# EAGLE design hsa_stm32_board (EAGLE 6.5.0)

## Sheet 1 of 3
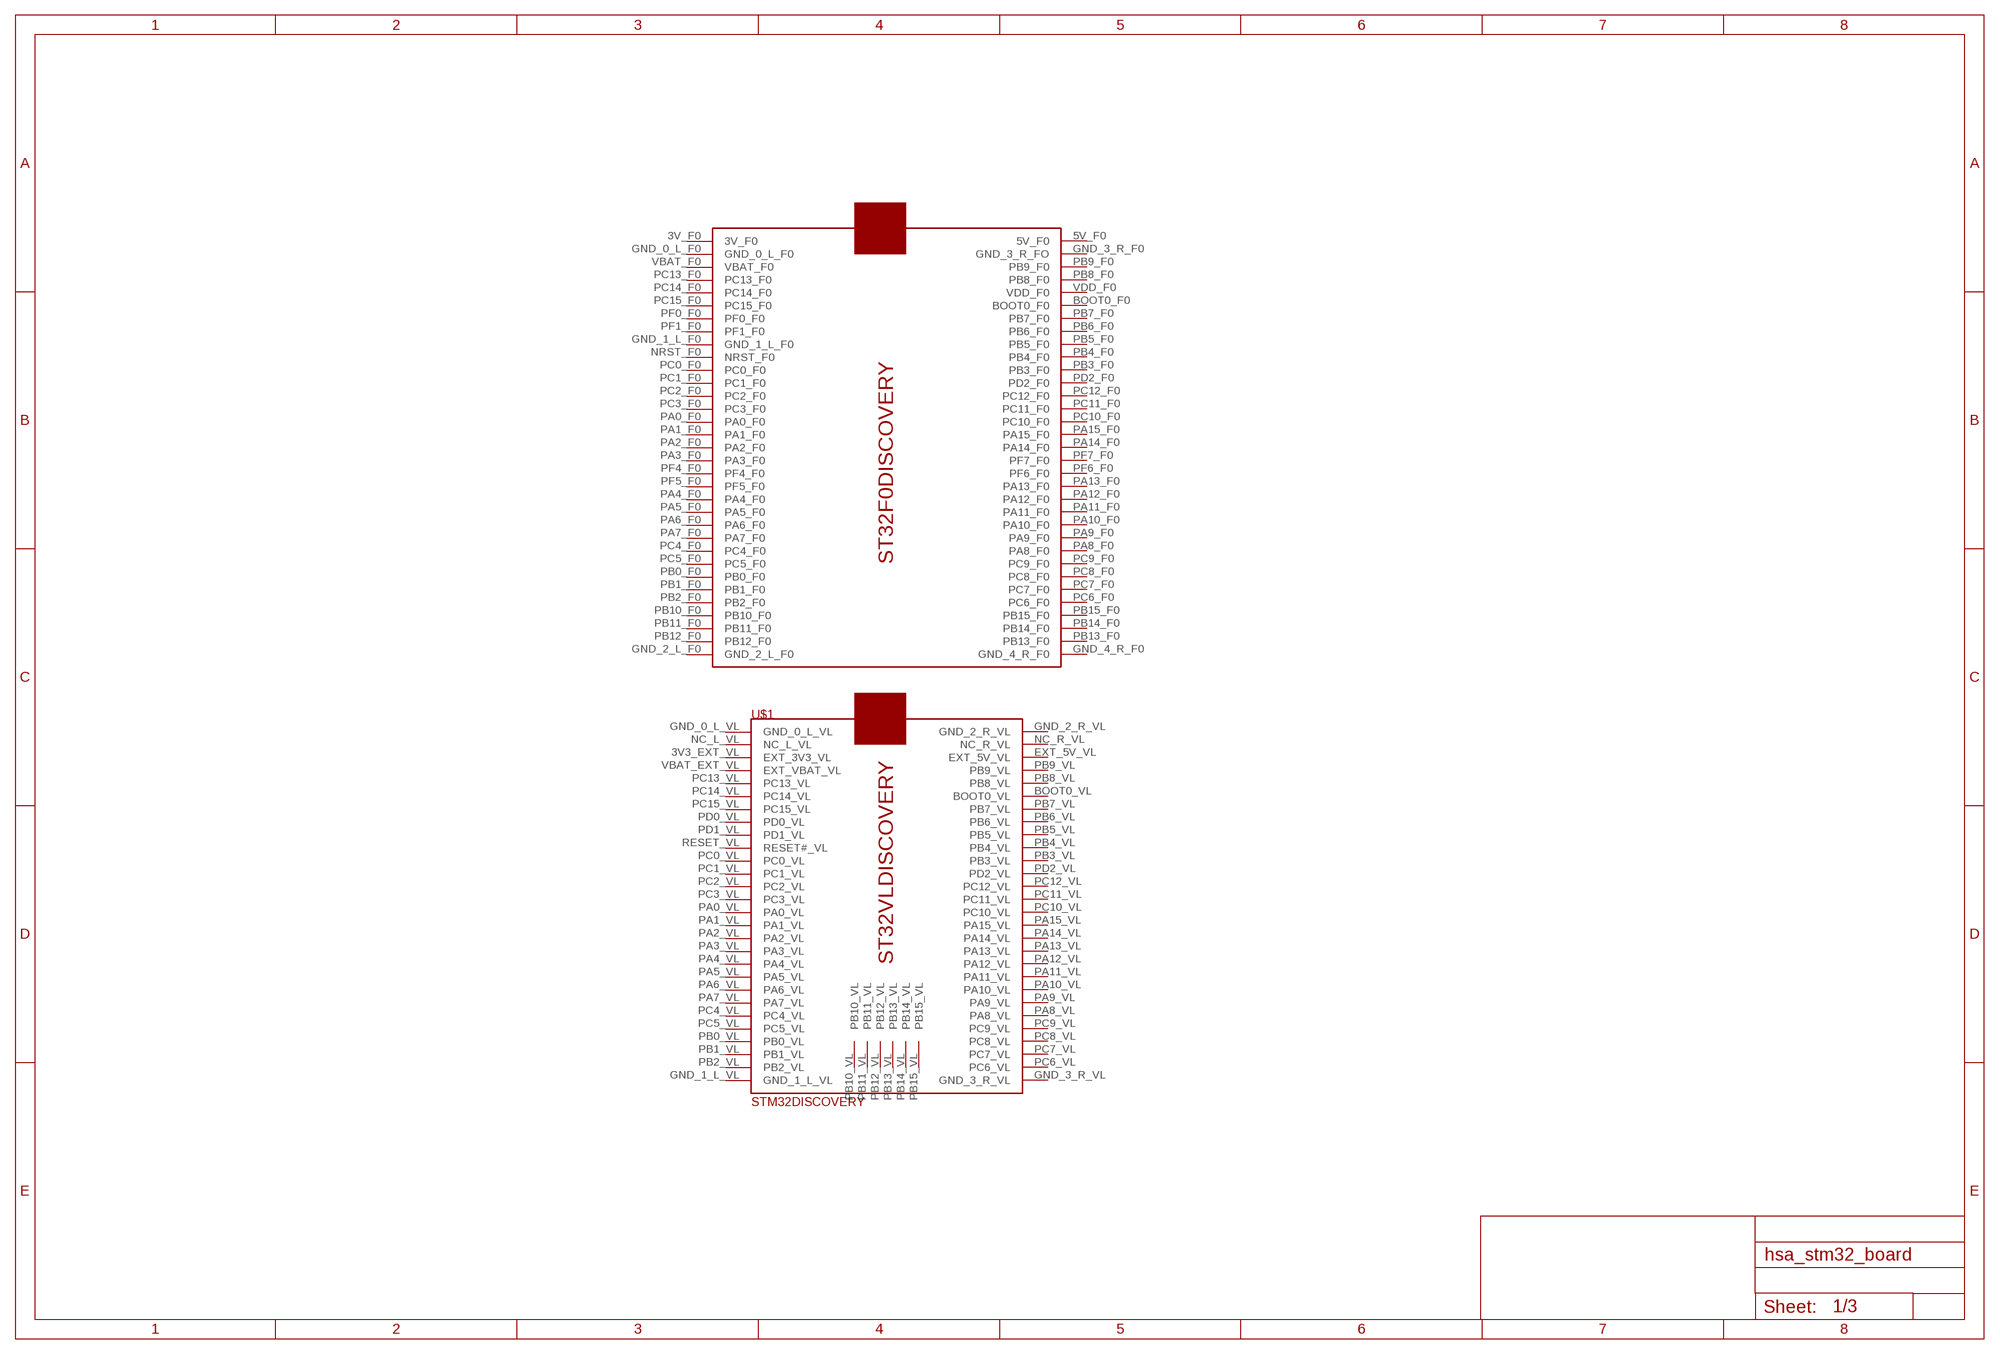
[diagram p0: schematic, sheet 1]

### Parts
U$1  STM32DISCOVERY  [STM32DISCOVERY]
Unconnected: U$1.3V3_EXT_VL(EXT_3V3_VL) U$1.3V_F0 U$1.5V_F0 U$1.BOOT0_F0 U$1.BOOT0_VL U$1.EXT_5V_VL U$1.GND_0_L_F0 U$1.GND_0_L_VL U$1.GND_1_L_F0 U$1.GND_2_L_F0 U$1.GND_2_R_VL U$1.GND_3_R_F0(GND_3_R_FO) U$1.GND_3_R_VL U$1.GND_4_R_F0 U$1.NC_L_VL U$1.NC_R_VL U$1.NRST_F0 U$1.PA0_F0 U$1.PA0_VL U$1.PA1_F0 U$1.PA1_VL U$1.PA2_F0 U$1.PA2_VL U$1.PA3_F0 U$1.PA3_VL U$1.PA4_F0 U$1.PA4_VL U$1.PA5_F0 U$1.PA5_VL U$1.PA6_F0 U$1.PA6_VL U$1.PA7_F0 U$1.PA7_VL U$1.PA8_F0 U$1.PA8_VL U$1.PA9_F0 U$1.PA9_VL U$1.PA10_F0 U$1.PA10_VL U$1.PA11_F0 U$1.PA11_VL U$1.PA12_F0 U$1.PA12_VL U$1.PA13_F0 U$1.PA13_VL U$1.PA14_F0 U$1.PA14_VL U$1.PA15_F0 U$1.PA15_VL U$1.PB0_F0 U$1.PB0_VL U$1.PB1_F0 U$1.PB1_VL U$1.PB2_F0 U$1.PB2_VL U$1.PB3_F0 U$1.PB3_VL U$1.PB4_F0 U$1.PB4_VL U$1.PB5_F0 U$1.PB5_VL U$1.PB6_F0 U$1.PB6_VL U$1.PB7_F0 U$1.PB7_VL U$1.PB8_F0 U$1.PB8_VL U$1.PB9_F0 U$1.PB9_VL U$1.PB10_F0 U$1.PB10_VL U$1.PB11_F0 U$1.PB11_VL U$1.PB12_F0 U$1.PB12_VL U$1.PB13_F0 U$1.PB13_VL U$1.PB14_F0 U$1.PB14_VL U$1.PB15_F0 U$1.PB15_VL U$1.PC0_F0 U$1.PC0_VL U$1.PC1_F0 U$1.PC1_VL U$1.PC2_F0 U$1.PC2_VL U$1.PC3_F0 U$1.PC3_VL U$1.PC4_F0 U$1.PC4_VL U$1.PC5_F0 U$1.PC5_VL U$1.PC6_F0 U$1.PC6_VL U$1.PC7_F0 U$1.PC7_VL U$1.PC8_F0 U$1.PC8_VL U$1.PC9_F0 U$1.PC9_VL U$1.PC10_F0 U$1.PC10_VL U$1.PC11_F0 U$1.PC11_VL U$1.PC12_F0 U$1.PC12_VL U$1.PC13_F0 U$1.PC13_VL U$1.PC14_F0 U$1.PC14_VL U$1.PC15_F0 U$1.PC15_VL U$1.PD0_VL U$1.PD1_VL U$1.PD2_F0 U$1.PD2_VL U$1.PF0_F0 U$1.PF1_F0 U$1.PF4_F0 U$1.PF5_F0 U$1.PF6_F0 U$1.PF7_F0 U$1.RESET_VL(RESET#_VL) U$1.VBAT_EXT_VL(EXT_VBAT_VL) U$1.VBAT_F0 U$1.VDD_F0

## Sheet 2 of 3
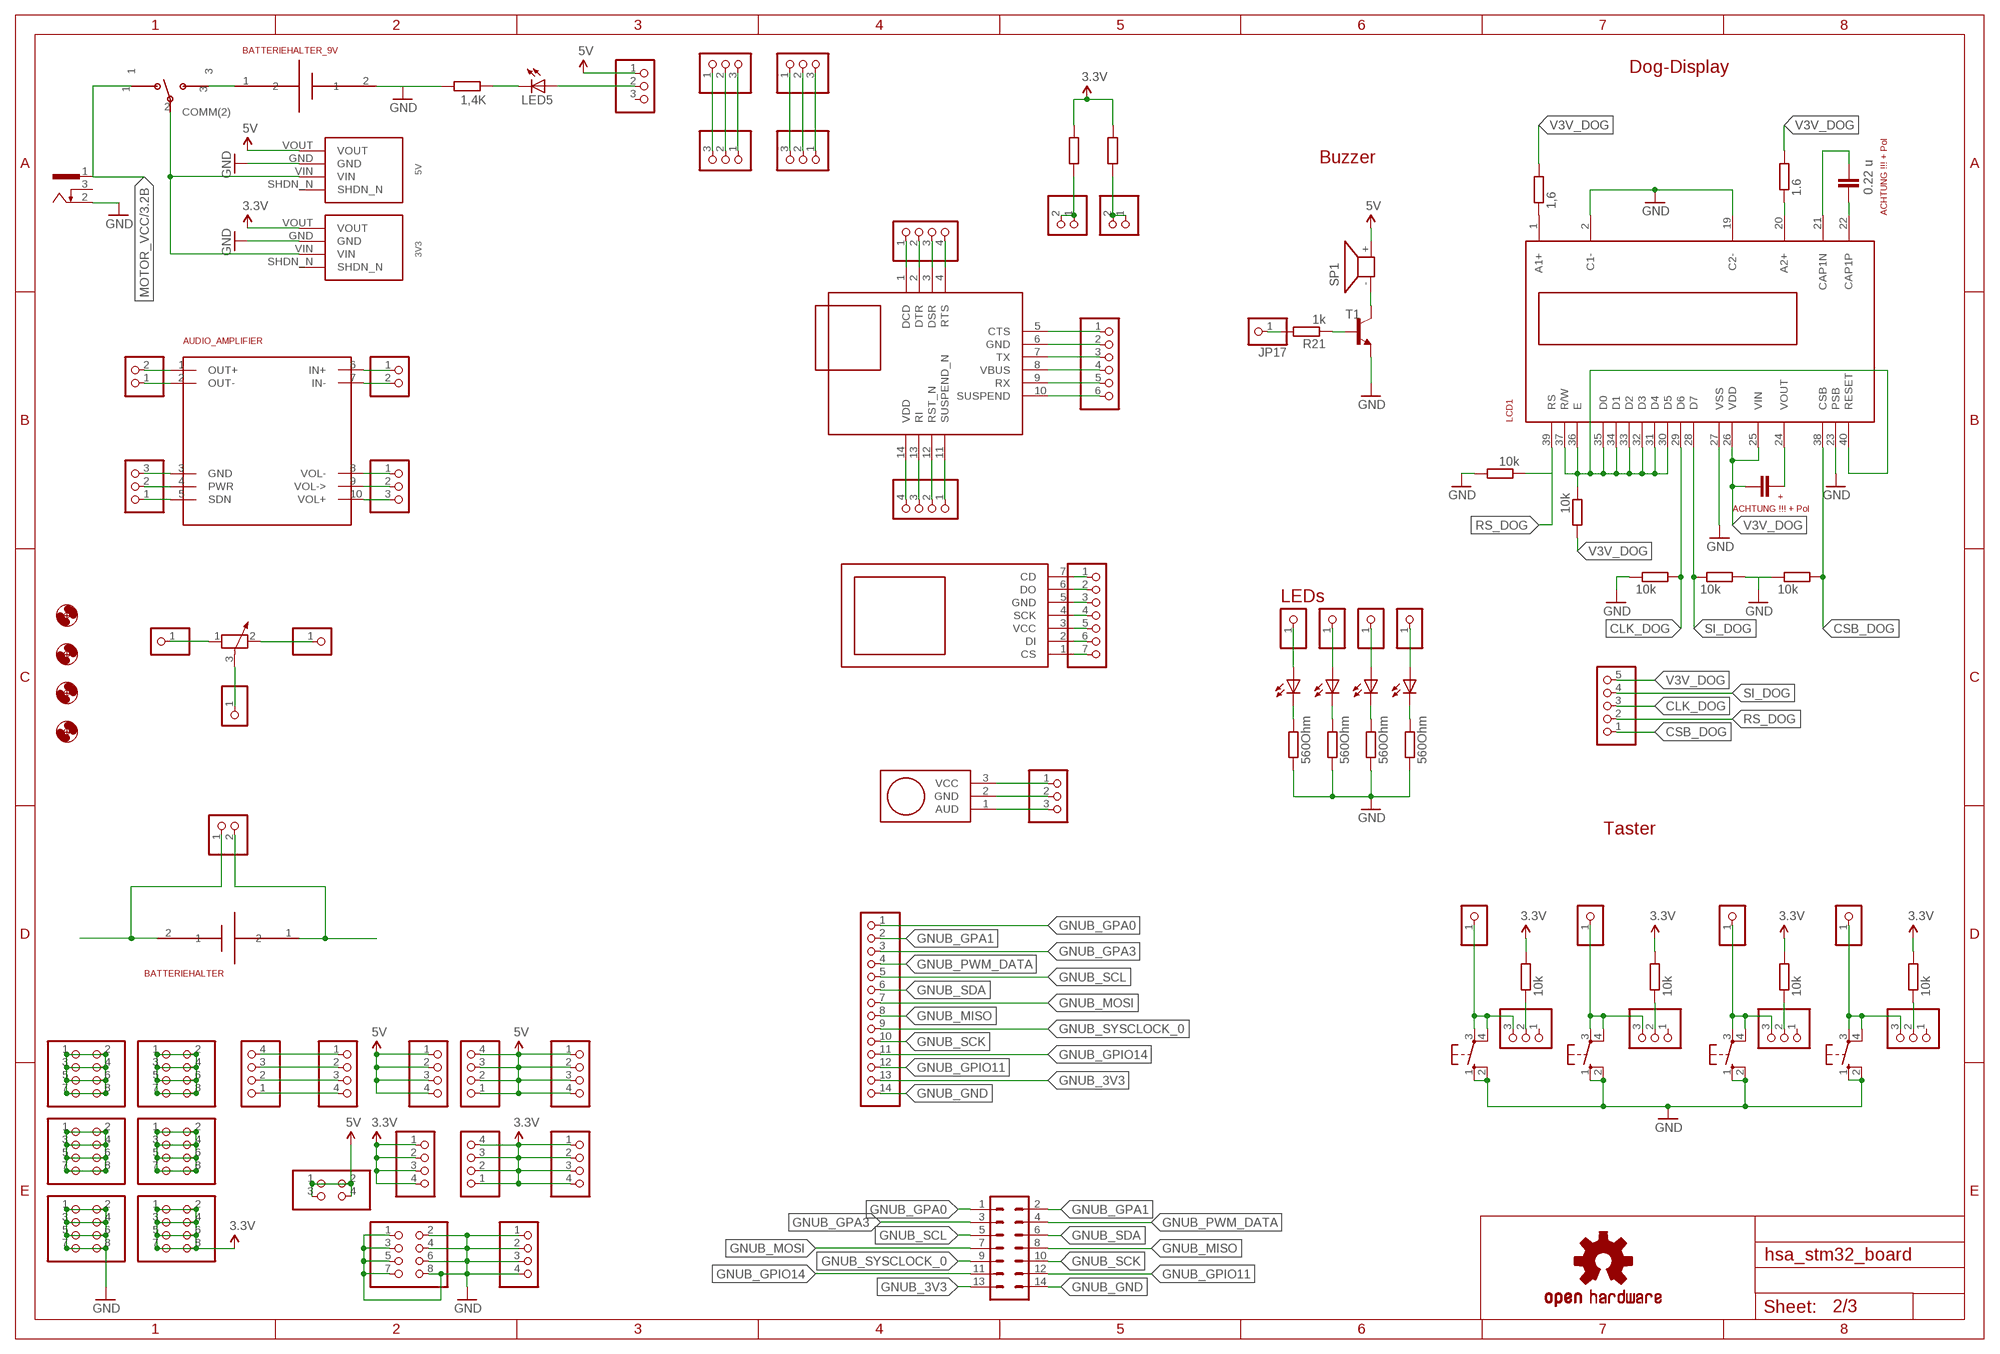
[diagram p1: schematic, sheet 2]

### Parts
3V3  VOLTAGE_REGULATOR  [VOL_REG]
5V  VOLTAGE_REGULATOR  [VOL_REG]
C2  0.22 u  C-EU025-040X050  [C025-040X050]
C3  1 u  C-EU025-040X050  [C025-040X050]
H1  MOUNT-HOLE6.0  [6,0]
H2  MOUNT-HOLE6.0  [6,0]
H3  MOUNT-HOLE6.0  [6,0]
H4  MOUNT-HOLE6.0  [6,0]
JP1  PINHD-1X5  [1X05]
JP4  PINHD-1X3  [1X03]
JP5  PINHD-1X1  [1X01]
JP6  PINHD-1X1  [1X01]
JP7  PINHD-1X1  [1X01]
JP8  PINHD-1X1  [1X01]
JP9  PINHD-1X1  [1X01]
JP10  PINHD-1X1  [1X01]
JP11  PINHD-1X1  [1X01]
JP12  PINHD-1X1  [1X01]
JP14  PINHD-1X1  [1X01]
JP15  PINHD-1X1  [1X01]
JP16  PINHD-1X1  [1X01]
JP17  PINHD-1X1  [1X01]
JP18  PINHD-2X4  [2X04]
JP24  PINHD-1X4  [1X04]
JP27  PINHD-1X4/90  [1X04/90]
JP28  PINHD-1X4  [1X04]
JP29  PINHD-1X4  [1X04]
JP30  PINHD-1X3  [1X03]
JP31  PINHD-1X2  [1X02]
JP32  PINHD-1X2  [1X02]
JP33  PINHD-1X3  [1X03]
JP34  PINHD-1X3  [1X03]
JP36  PINHD-1X4  [1X04]
JP37  PINHD-1X4  [1X04]
JP38  PINHD-1X6  [1X06]
JP39  PINHD-1X7  [1X07]
JP40  PINHD-1X4  [1X04]
JP41  PINHD-1X4  [1X04]
JP42  PINHD-1X4  [1X04]
JP43  PINHD-1X2  [1X02]
JP44  PINHD-2X4  [2X04]
JP45  PINHD-2X4  [2X04]
JP47  PINHD-1X4  [1X04]
JP48  PINHD-1X4  [1X04]
JP49  PINHD-1X3/90  [1X03/90]
JP50  PINHD-1X3  [1X03]
JP51  PINHD-1X3/90  [1X03/90]
JP52  PINHD-1X3  [1X03]
JP59  PINHD-1X3  [1X03]
JP60  PINHD-1X3  [1X03]
JP61  PINHD-1X3  [1X03]
JP62  PINHD-1X3  [1X03]
JP64  PINHD-1X14  [1X14]
JP65  PINHD-1X2  [1X02]
JP66  PINHD-1X2  [1X02]
JP67  PINHD-2X4  [2X04]
JP68  PINHD-2X4  [2X04]
JP69  PINHD-2X4  [2X04]
JP70  PINHD-2X4  [2X04]
JP71  PINHD-2X2  [2X02]
LCD1  ZEITERFASSUNG_-OPTO_DOGM  [ZEITERFASSUNG_-OPTO_DOGM]
LED1  LED5MM  [LED5MM]
LED2  LED5MM  [LED5MM]
LED3  LED5MM  [LED5MM]
LED4  LED5MM  [LED5MM]
LED5  LED5MM  [LED5MM]
LOGO1  OSHW-LOGOL  [OSHW-LOGO-L]
R1  560Ohm  R-EU_0207/10  [0207/10]
R2  560Ohm  R-EU_0207/10  [0207/10]
R3  560Ohm  R-EU_0207/10  [0207/10]
R4  560Ohm  R-EU_0207/10  [0207/10]
R5  RCL_POTENTIOMETER_PT-10  [RCL_PT-10]
R6  1,4K  R-EU_0207/10  [0207/10]
R7  1.6  R-EU_0207/10  [0207/10]
R8  1,6  R-EU_0207/10  [0207/10]
R9  10k  R-EU_0207/10  [0207/10]
R10  10k  R-EU_0207/10  [0207/10]
R11  10k  R-EU_0207/10  [0207/10]
R12  10k  R-EU_0207/10  [0207/10]
R13  10k  R-EU_0207/10  [0207/10]
R14  10k  R-EU_0207/10  [0207/10]
R15  10k  R-EU_0207/10  [0207/10]
R16  10k  R-EU_0207/10  [0207/10]
R17  10k  R-EU_0207/10  [0207/10]
R21  1k  R-EU_0207/10  [0207/10]
R22  R-EU_0207/10  [0207/10]
R23  R-EU_0207/10  [0207/10]
S1  CPU-K_MODULE_REV3.0_SWITCH-OMRON_10-XX  [CPU-K_MODULE_REV3.0_SWITCH-OMRON_B3F-10XX]
S2  CPU-K_MODULE_REV3.0_SWITCH-OMRON_10-XX  [CPU-K_MODULE_REV3.0_SWITCH-OMRON_B3F-10XX]
S3  CPU-K_MODULE_REV3.0_SWITCH-OMRON_10-XX  [CPU-K_MODULE_REV3.0_SWITCH-OMRON_B3F-10XX]
S4  CPU-K_MODULE_REV3.0_SWITCH-OMRON_10-XX  [CPU-K_MODULE_REV3.0_SWITCH-OMRON_B3F-10XX]
SP1  BUZZER_F/PMX04  [BUZZER_F/PMX04A]
SV3  ML14  [ML14]
T1  TRANSISTOR_BC337  [TRANSISTOR_TO92]
U$2  USB_TO_SERIAL_ADAPTER  [USB_TO_SERIAL]
U$4  KIPPSCHALTER(EIN,AUS,EIN)  [KIPPSCHALTER]
U$5  MIC  [MIC]
U$6  BATTERIEHALTER  [BH_KZH_20]
U$7  BATTERIEHALTER_9V  [BATTERIEHALTER_9V]
U$9  AUDIO_AMPLIFIER  [AUDIO_AMPLIFIER]
U$12  MICRO_SD_HALTER  [MIKRO_SD_HALTER]
X1  733980-62  [733980-62]

### Nets
3.3V: 3V3.VOUT JP29.1 JP29.2 JP29.3 JP29.4 JP41.1 JP41.2 JP41.3 JP41.4 JP47.1 JP47.2 JP47.3 JP47.4 JP70.1 JP70.2 JP70.3 JP70.4 JP70.5 JP70.6 JP70.7 JP70.8 R14.2 R15.2 R16.2 R17.2 R22.2 R23.2 ; also sheet 3
5V: 5V.VOUT JP4.1 JP28.1 JP28.2 JP28.3 JP28.4 JP40.1 JP40.2 JP40.3 JP40.4 JP48.1 JP48.2 JP48.3 JP48.4 JP71.1 JP71.2 JP71.3 JP71.4 SP1.+ ; also sheet 3
CLK_DOG: JP1.3 LCD1.29(D6) R11.2
CSB_DOG: JP1.1 LCD1.38(CSB) R13.2
GND: 3V3.GND 5V.GND JP18.1 JP18.2 JP18.3 JP18.4 JP18.5 JP18.6 JP18.7 JP18.8 JP42.1 JP42.2 JP42.3 JP42.4 JP67.1 JP67.2 JP67.3 JP67.4 JP67.5 JP67.6 JP67.7 JP67.8 LCD1.2(C1-) LCD1.19(C2-) LCD1.23(PSB) LCD1.27(VSS) R1.1 R2.1 R3.1 R4.1 R6.2 R9.2 R11.1 R12.2 R13.1 S1.1(S) S1.2(S1) S2.1(S) S2.2(S1) S3.1(S) S3.2(S1) S4.1(S) S4.2(S1) T1.1(E) U$7.2 X1.2 ; also sheet 3
GNUB_3V3: JP64.13 SV3.13
GNUB_GND: JP64.14 SV3.14
GNUB_GPA0: JP64.1 SV3.1
GNUB_GPA1: JP64.2 SV3.2
GNUB_GPA3: JP64.3 SV3.3
GNUB_GPIO11: JP64.12 SV3.12
GNUB_GPIO14: JP64.11 SV3.11
GNUB_MISO: JP64.8 SV3.8
GNUB_MOSI: JP64.7 SV3.7
GNUB_PWM_DATA: JP64.4 SV3.4
GNUB_SCK: JP64.10 SV3.10
GNUB_SCL: JP64.5 SV3.5
GNUB_SDA: JP64.6 SV3.6
GNUB_SYSCLOCK_0: JP64.9 SV3.9
MOTOR_VCC: U$4.1 X1.1 ; also sheet 3
N$1: C2.2 LCD1.22(CAP1P)
N$2: C2.1 LCD1.21(CAP1N)
N$3: LCD1.20(A2+) R7.1
N$4: LCD1.30(D5) LCD1.31(D4) LCD1.32(D3) LCD1.33(D2) LCD1.34(D1) LCD1.35(D0) LCD1.36(E) LCD1.37(R/W) LCD1.40(RESET) R10.1
N$5: LCD1.1(A1+) R8.1
N$6: C3.2 LCD1.24(VOUT)
N$7: LED4.K(C) R4.2
N$8: LED3.K(C) R3.2
N$9: LED2.K(C) R2.2
N$10: LED1.K(C) R1.2
N$13: JP6.1 LED2.A
N$14: JP7.1 LED3.A
N$15: JP8.1 LED4.A
N$16: 3V3.VIN 5V.VIN U$4.2(COMM(2))
N$18: JP62.2 R14.1
N$19: JP61.2 R15.1
N$20: JP9.1 JP62.3 S1.3(P) S1.4(P1)
N$21: JP10.1 JP61.3 S2.3(P) S2.4(P1)
N$22: JP60.2 R16.1
N$23: JP59.2 R17.1
N$24: JP11.1 JP60.3 S3.3(P) S3.4(P1)
N$25: JP12.1 JP59.3 S4.3(P) S4.4(P1)
N$27: U$4.3 U$7.1
N$28: LED5.K(C) R6.1
N$29: JP4.2 LED5.A
N$30: JP5.1 LED1.A
N$33: JP14.1 R5.3
N$34: JP16.1 R5.1
N$35: JP15.1 R5.2
N$36: SP1.- T1.3(C)
N$37: JP43.1 U$6.2
N$39: JP17.1 R21.2
N$40: JP43.2 U$6.1
N$58: JP24.4 JP27.1
N$62: JP24.3 JP27.2
N$63: JP24.2 JP27.3
N$64: JP24.1 JP27.4
N$65: JP32.2 U$9.1(OUT+)
N$66: JP32.1 U$9.2(OUT-)
N$67: JP31.1 U$9.6(IN+)
N$68: JP31.2 U$9.7(IN-)
N$69: JP34.1 U$9.8(VOL-)
N$70: JP49.3 JP50.1
N$71: JP49.2 JP50.2
N$72: JP49.1 JP50.3
N$73: JP30.1 U$5.3(VCC)
N$74: JP30.2 U$5.2(GND)
N$75: JP30.3 U$5.1(AUD)
N$76: JP34.2 U$9.9(VOL->)
N$77: JP34.3 U$9.10(VOL+)
N$78: JP33.3 U$9.3(GND)
N$79: JP33.2 U$9.4(PWR)
N$80: JP33.1 U$9.5(SDN)
N$88: JP36.1 U$2.1(DCD)
N$89: JP36.2 U$2.2(DTR)
N$90: JP36.3 U$2.3(DSR)
N$91: JP36.4 U$2.4(RTS)
N$92: JP37.1 U$2.11(SUSPEND_N)
N$93: JP37.2 U$2.12(RST_N)
N$94: JP37.3 U$2.13(RI)
N$95: JP37.4 U$2.14(VDD)
N$96: JP38.1 U$2.5(CTS)
N$97: JP38.2 U$2.6(GND)
N$98: JP38.3 U$2.7(TX)
N$99: JP38.4 U$2.8(VBUS)
N$100: JP38.5 U$2.9(RX)
N$101: JP38.6 U$2.10(SUSPEND)
N$102: JP39.1 U$12.7(CD)
N$103: JP39.2 U$12.6(DO)
N$104: JP39.3 U$12.5(GND)
N$105: JP39.4 U$12.4(SCK)
N$106: JP39.5 U$12.3(VCC)
N$107: JP39.6 U$12.2(DI)
N$108: JP39.7 U$12.1(CS)
N$109: JP51.3 JP52.1
N$110: JP51.2 JP52.2
N$111: JP51.1 JP52.3
N$112: R21.1 T1.2(B)
N$125: JP65.1 JP65.2 R23.1
N$126: JP66.1 JP66.2 R22.1
N$128: JP44.1 JP44.2 JP44.3 JP44.4 JP44.5 JP44.6 JP44.7 JP44.8
N$132: JP45.1 JP45.2 JP45.3 JP45.4 JP45.5 JP45.6 JP45.7 JP45.8
N$136: JP68.1 JP68.2 JP68.3 JP68.4 JP68.5 JP68.6 JP68.7 JP68.8
N$140: JP69.1 JP69.2 JP69.3 JP69.4 JP69.5 JP69.6 JP69.7 JP69.8
RS_DOG: JP1.2 LCD1.39(RS) R9.1
SI_DOG: JP1.4 LCD1.28(D7) R12.1
V3V_DOG: C3.1 JP1.5 LCD1.25(VIN) LCD1.26(VDD) R7.2 R8.2 R10.2
Unconnected: 3V3.SHDN_N 5V.SHDN_N JP4.3 JP59.1 JP60.1 JP61.1 JP62.1 X1.3

### Notes on the sheet
- Dog-Display
- Buzzer
- ACHTUNG !!! + Pol
- +
- ACHTUNG !!! + Pol
- LEDs
- Taster

## Sheet 3 of 3
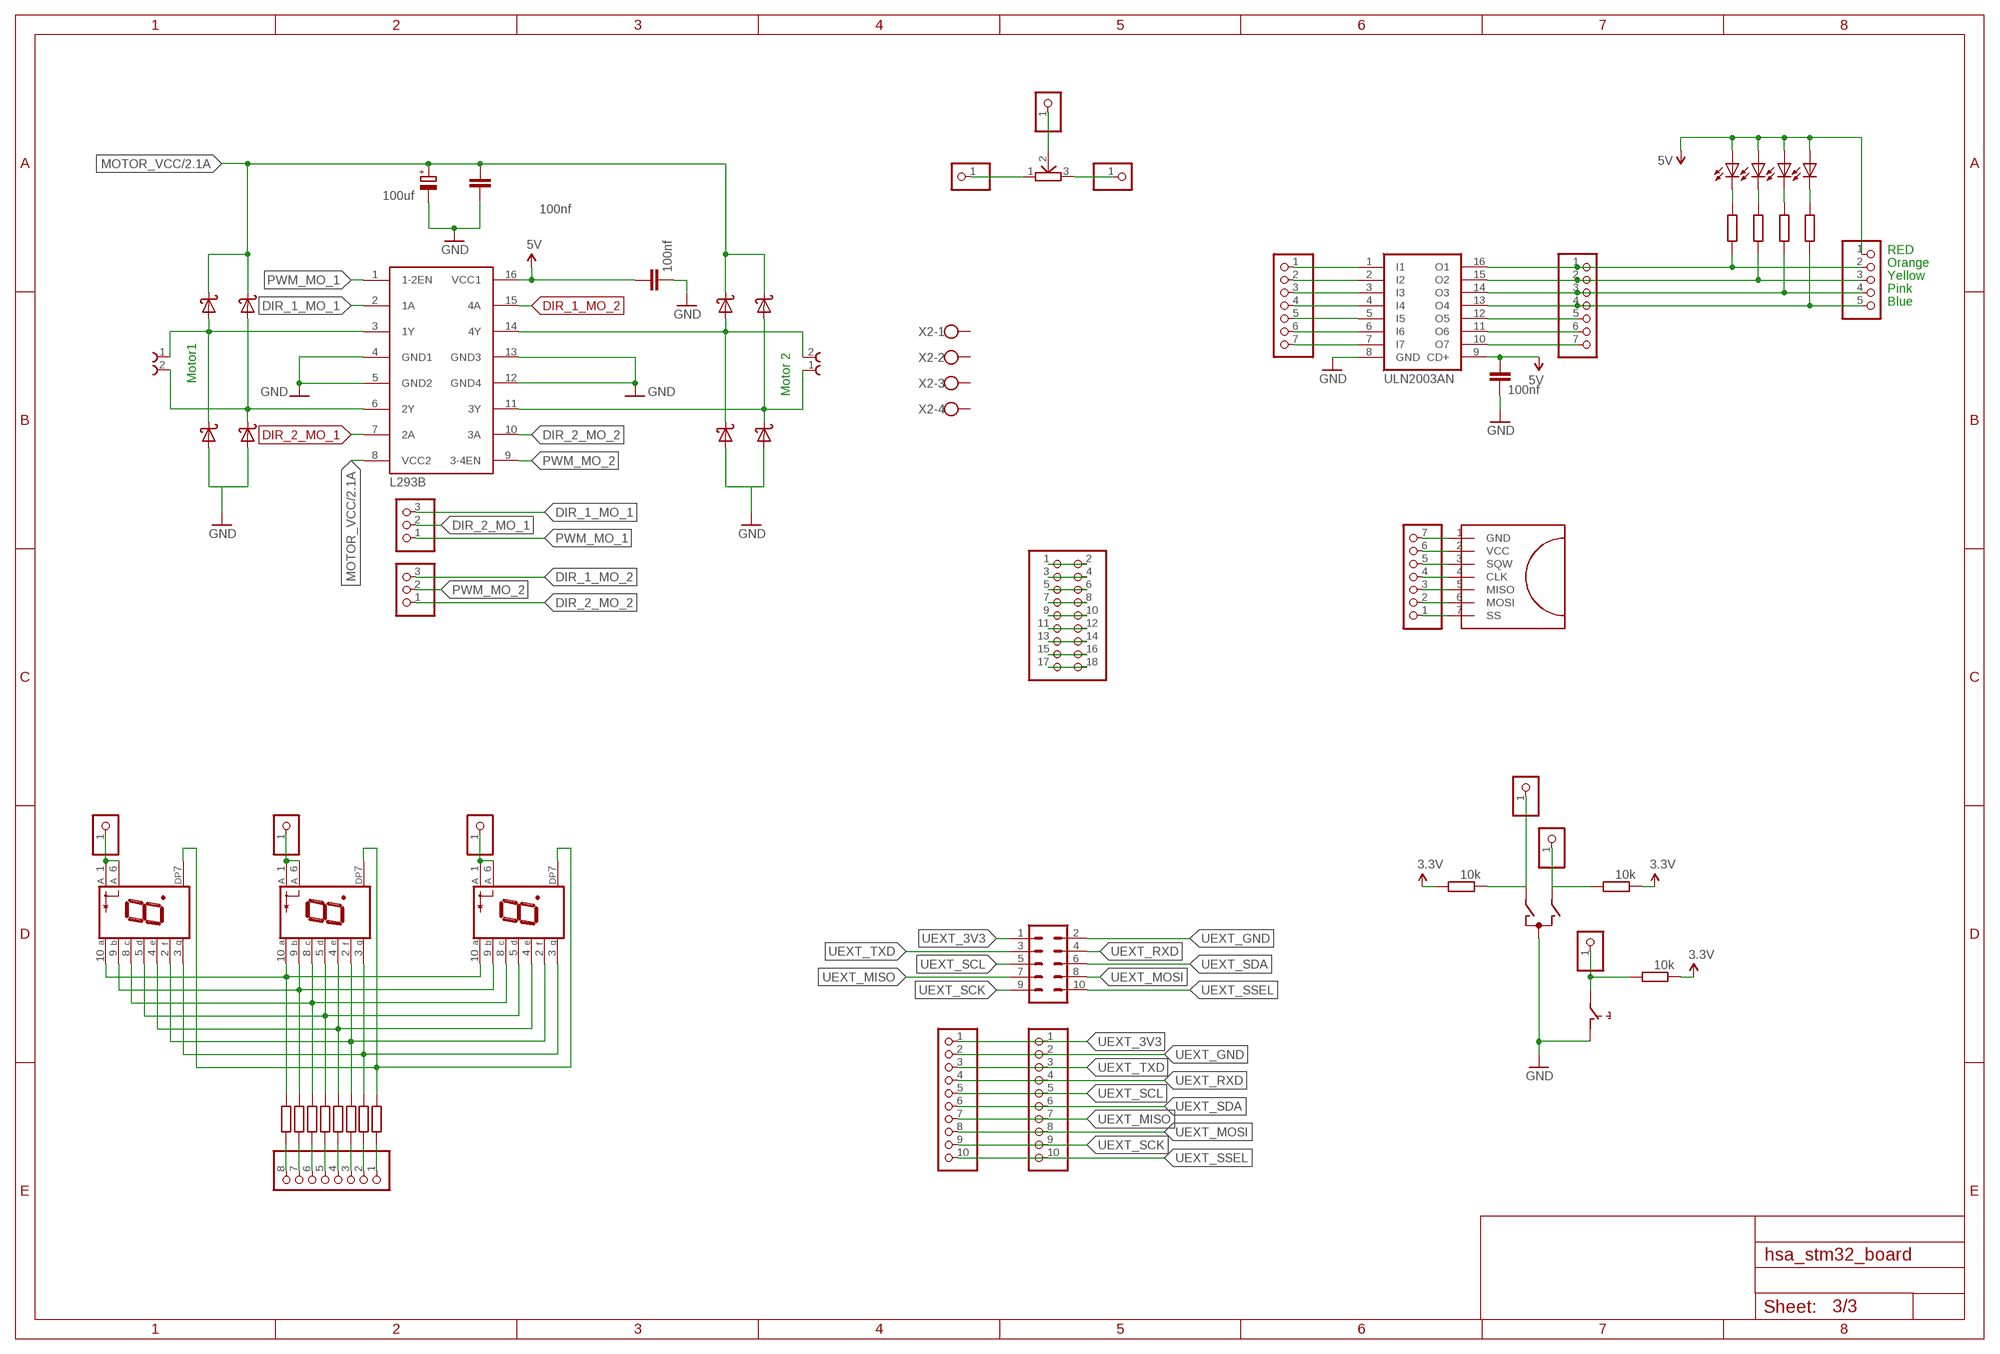
[diagram p2: schematic, sheet 3]

### Parts
C4  100nf  RCL_C-EU025-040X050  [RCL_C025-040X050]
C5  100nf  RCL_C-EU025-040X050  [RCL_C025-040X050]
C6  100nf  RCL_C-EU025-040X050  [RCL_C025-040X050]
C7  100uf  RCL_CPOL-EUE2.5-6  [RCL_E2,5-6]
D1  1N5819  [DO41-10]
D2  1N5819  [DO41-10]
D3  1N5819  [DO41-10]
D4  1N5819  [DO41-10]
D5  1N5819  [DO41-10]
D6  1N5819  [DO41-10]
D7  1N5819  [DO41-10]
D8  1N5819  [DO41-10]
IC1  ULN2003AN  [DIL16]
IC2  L293D  [DIL16]
JP2  PINHD-1X1  [1X01]
JP3  PINHD-1X1  [1X01]
JP13  PINHD-1X1  [1X01]
JP20  PINHD-1X10  [1X10]
JP21  PINHD-1X7  [1X07]
JP22  PINHD-1X8  [1X08]
JP23  PINHD-1X1  [1X01]
JP25  PINHD-1X5/90  [1X05/90]
JP26  PINHD-1X7  [1X07]
JP35  PINHD-1X7  [1X07]
JP53  PINHD-1X1  [1X01]
JP54  PINHD-1X1  [1X01]
JP55  PINHD-1X1  [1X01]
JP56  PINHD-2X9  [2X09]
JP57  PINHD-1X3  [1X03]
JP58  PINHD-1X3  [1X03]
JP63  PINHD-1X10  [1X10]
JP72  PINHD-1X1  [1X01]
JP73  PINHD-1X1  [1X01]
K1  691210910002  [691210910002]
K2  691210910002  [691210910002]
LED6  LA-401MD  [LA-401]
LED7  LA-401MD  [LA-401]
LED8  LA-401MD  [LA-401]
LED9  LED3MM  [LED3MM]
LED10  LED3MM  [LED3MM]
LED11  LED3MM  [LED3MM]
LED12  LED3MM  [LED3MM]
R18  10k  R-EU_0207/10  [0207/10]
R19  10k  R-EU_0207/10  [0207/10]
R20  10k  R-EU_0207/10  [0207/10]
R24  R-EU_0207/10  [0207/10]
R25  R-EU_0207/10  [0207/10]
R26  R-EU_0207/10  [0207/10]
R27  R-EU_0207/10  [0207/10]
R28  R-EU_0207/10  [0207/10]
R29  R-EU_0207/10  [0207/10]
R30  R-EU_0207/10  [0207/10]
R31  R-EU_0207/10  [0207/10]
R32  R-EU_0207/10  [0207/10]
R33  R-EU_0207/10  [0207/10]
R34  R-EU_0207/10  [0207/10]
R35  R-EU_0207/10  [0207/10]
SV2  CON-HARTING-ML_ML10  [CON-HARTING-ML_ML10]
SW1  EC12E_SW  [ALPS_EC12E_SW]
U$10  RTC  [RTC]
U$17  THUMBWHEEL_POTI  [THUMBWHEEL_POTI]
X2  W237-4  [W237-4]

### Nets
3.3V: R18.1 R19.2 R20.1 ; also sheet 2
5V: C4.1 C6.1 IC1.9(CD+) IC2.16(VCC1) JP25.1 LED9.A LED10.A LED11.A LED12.A ; also sheet 2
DIR_1_MO_1: IC2.2(1A) JP57.3
DIR_1_MO_2: IC2.15(4A) JP58.3
DIR_2_MO_1: IC2.7(2A) JP57.2
DIR_2_MO_2: IC2.10(3A) JP58.1
GND: C4.2 C5.2 C6.2 C7.- D3.A D4.A D7.A D8.A IC1.8(GND) IC2.4(GND1) IC2.5(GND2) IC2.12(GND4) IC2.13(GND3) SW1.C SW1.D ; also sheet 2
MOTOR_VCC: C5.1 C7.+ D1.C D2.C D5.C D6.C IC2.8(VCC2) ; also sheet 2
N$12: JP2.1 R19.1 SW1.A
N$17: LED9.K(C) R32.2
N$26: LED10.K(C) R34.2
N$31: JP3.1 R18.2 SW1.B
N$32: JP13.1 R20.2 SW1.E
N$38: D2.A D4.C IC2.14(4Y) K1.2
N$41: IC1.12(O5) JP21.5
N$42: IC1.11(O6) JP21.6
N$43: IC1.10(O7) JP21.7
N$44: IC1.5(I5) JP26.5
N$45: IC1.16(O1) JP21.1 JP25.2 R32.1
N$46: IC1.15(O2) JP21.2 JP25.3 R34.1
N$47: IC1.6(I6) JP26.6
N$48: IC1.7(I7) JP26.7
N$49: JP56.1 JP56.2
N$50: JP56.3 JP56.4
N$51: IC1.14(O3) JP21.3 JP25.4 R33.1
N$52: IC1.13(O4) JP21.4 JP25.5 R35.1
N$53: JP56.5 JP56.6
N$54: IC1.4(I4) JP26.4
N$55: IC1.3(I3) JP26.3
N$56: IC1.2(I2) JP26.2
N$57: IC1.1(I1) JP26.1
N$59: JP56.7 JP56.8
N$60: JP56.9 JP56.10
N$61: JP56.11 JP56.12
N$81: JP35.1 U$10.7(SS)
N$82: JP35.2 U$10.6(MOSI)
N$83: JP35.3 U$10.5(MISO)
N$84: JP35.4 U$10.4(CLK)
N$85: JP35.5 U$10.3(SQW)
N$86: JP35.6 U$10.2(VCC)
N$87: JP35.7 U$10.1(GND)
N$113: D1.A D3.C IC2.11(3Y) K1.1
N$114: JP55.1 U$17.1(A)
N$115: JP54.1 U$17.2(W)
N$116: D6.A D8.C IC2.3(1Y) K2.1
N$117: D5.A D7.C IC2.6(2Y) K2.2
N$118: JP53.1 U$17.3(B)
N$119: LED12.K(C) R35.2
N$120: LED11.K(C) R33.2
N$122: JP56.13 JP56.14
N$123: JP56.15 JP56.16
N$124: JP56.17 JP56.18
N$127: JP22.8 R24.1
N$131: LED6.9(B) LED7.9(B) LED8.9(B) R25.2
N$133: LED6.8(C) LED7.8(C) LED8.8(C) R26.2
N$134: LED6.5(D) LED7.5(D) LED8.5(D) R27.2
N$135: LED6.4(E) LED7.4(E) LED8.4(E) R28.2
N$139: LED6.2(F) LED7.2(F) LED8.2(F) R29.2
N$141: LED6.3(G) LED7.3(G) LED8.3(G) R30.2
N$142: LED6.7(DP) LED7.7(DP) LED8.7(DP) R31.2
N$143: LED6.10(A) LED7.10(A) LED8.10(A) R24.2
N$144: JP22.7 R25.1
N$145: JP22.6 R26.1
N$146: JP22.5 R27.1
N$147: JP22.4 R28.1
N$148: JP22.3 R29.1
N$149: JP22.2 R30.1
N$150: JP22.1 R31.1
N$151: JP72.1 LED6.1(A) LED6.6(A)
N$152: JP73.1 LED7.1(A) LED7.6(A)
N$153: JP23.1 LED8.1(A) LED8.6(A)
PWM_MO_1: IC2.1(1-2EN) JP57.1
PWM_MO_2: IC2.9(3-4EN) JP58.2
UEXT_3V3: JP20.1 JP63.1 SV2.1
UEXT_GND: JP20.2 JP63.2 SV2.2
UEXT_MISO: JP20.7 JP63.7 SV2.7
UEXT_MOSI: JP20.8 JP63.8 SV2.8
UEXT_RXD: JP20.4 JP63.4 SV2.4
UEXT_SCK: JP20.9 JP63.9 SV2.9
UEXT_SCL: JP20.5 JP63.5 SV2.5
UEXT_SDA: JP20.6 JP63.6 SV2.6
UEXT_SSEL: JP20.10 JP63.10 SV2.10
UEXT_TXD: JP20.3 JP63.3 SV2.3
Unconnected: SW1.GND1(G) SW1.GND2(G) X2.1 X2.2 X2.3 X2.4

### Notes on the sheet
- RED
- Orange
- Yellow
- Pink
- Blue
- Motor1
- Motor 2
- L293B

## Power pins joined to a net without a drawn wire
GND_1_L_VL: U$1.GND_1_L_VL

## Library data of the parts
3V3 5V = hsa_stm32_discovery_board:VOLTAGE_REGULATOR
C2 C3 = resistor:C-EU: CAPACITOR, European symbol
C4-C6 = v100_knicker:RCL_C-EU: CAPACITOR, European symbol
C7 = CPU-k_module_Rev3.0:RCL_CPOL-EU: POLARIZED CAPACITOR, European symbol
D1-D8 = CEDT:1N5819: DIODE general purpose rectifier, 1 A
H1-H4 = holes:MOUNT-HOLE: MOUNTING HOLE with drill center marker
IC1 = uln-udn:ULN2003A: DRIVER ARRAY
IC2 = st-microelectronics:L293D: PUSH-PULL 4 CHANNEL DRIVER; MPN: L293D; OC_FARNELL: 9589619; OC_NEWARK: 56P8249
JP1 JP25 = pinhead:PINHD-1X5: PIN HEADER
JP2 JP3 JP5-JP17 JP23 JP53-JP55 JP72 JP73 = pinhead:PINHD-1X1: PIN HEADER
JP4 JP30 JP33 JP34 JP49-JP52 JP57-JP62 = pinhead:PINHD-1X3: PIN HEADER
JP18 JP44 JP45 JP67-JP70 = pinhead:PINHD-2X4: PIN HEADER
JP20 JP63 = pinhead:PINHD-1X10: PIN HEADER
JP21 JP26 JP35 JP39 = pinhead:PINHD-1X7: PIN HEADER
JP22 = pinhead:PINHD-1X8: PIN HEADER
JP24 JP27-JP29 JP36 JP37 JP40-JP42 JP47 JP48 = pinhead:PINHD-1X4: PIN HEADER
JP31 JP32 JP43 JP65 JP66 = pinhead:PINHD-1X2: PIN HEADER
JP38 = pinhead:PINHD-1X6: PIN HEADER
JP56 = pinhead:PINHD-2X9: PIN HEADER
JP64 = pinhead:PINHD-1X14: PIN HEADER
JP71 = pinhead:PINHD-2X2: PIN HEADER
K1 K2 = Wuerth_Elektronik_eiCan_14_Terminal_Blocks_WR-TBL_2_0:691210910002: WR-TBL Serie 2109 - 2.54mm Horizontal Entry Modular with Rising Cage Clamp - 0.8mm2 Wires, 2 Pins
LCD1 = elatus:ZEITERFASSUNG_-OPTO_DOGM
LED1-LED5 LED9-LED12 = led:LED: LED OSRAM: - CHIPLED LG R971, LG N971, LY N971, LG Q971, LY Q971, LO R971, LY R971 LH N974, LH R974 LS Q976, LO Q976, LY Q976 LO Q996 - Hyper CHIPLED LW Q18S LB Q993, LB Q99A, LB R99A - SideLED LS A670, LO A670, LY A670, LG A670, LP A670 LB A673, LV A673, LT A673, LW A673 LH A674 LY A675 LS A676, LA A676, LO A676, LY A676, LW A676 LS A679, LY A679, LG A679 - Hyper Micro SIDELED® LS Y876, LA Y876, LO Y876, LY Y876 LT Y87S - SmartLED LW L88C, LW L88S LB L89C, LB L89S, LG L890 LS L89K, LO L89K, LY L89K LS L896, LA L896, LO L896, LY L896 - TOPLED LS T670, LO T670, LY T670, LG T670, LP T670 LSG T670, LSP T670, LSY T670, LOP T670, LYG T670 LG T671, LOG T671, LSG T671 LB T673, LV T673, LT T673, LW T673 LH T674 LS T676, LA T676, LO T676, LY T676, LB T676, LH T676, LSB T676, LW T676 LB T67C, LV T67C, LT T67C, LS T67K, LO T67K, LY T67K, LW E67C LS E67B, LA E67B, LO E67B, LY E67B, LB E67C, LV E67C, LT E67C LW T67C LS T679, LY T679, LG T679 LS T770, LO T770, LY T770, LG T770, LP T770 LB T773, LV T773, LT T773, LW T773 LH T774 LS E675, LA E675, LY E675, LS T675 LS T776, LA T776, LO T776, LY T776, LB T776 LHGB T686 LT T68C, LB T68C - Hyper Mini TOPLED® LB M676 - Mini TOPLED Santana® LG M470 LS M47K, LO M47K, LY M47K Source: http://www.osram.convergy.de LUXEON: - LUMILED® LXK2-PW12-R00, LXK2-PW12-S00, LXK2-PW14-U00, LXK2-PW14-V00 LXK2-PM12-R00, LXK2-PM12-S00, LXK2-PM14-U00 LXK2-PE12-Q00, LXK2-PE12-R00, LXK2-PE12-S00, LXK2-PE14-T00, LXK2-PE14-U00 LXK2-PB12-K00, LXK2-PB12-L00, LXK2-PB12-M00, LXK2-PB14-N00, LXK2-PB14-P00, LXK2-PB14-Q00 LXK2-PR12-L00, LXK2-PR12-M00, LXK2-PR14-Q00, LXK2-PR14-R00 LXK2-PD12-Q00, LXK2-PD12-R00, LXK2-PD12-S00 LXK2-PH12-R00, LXK2-PH12-S00 LXK2-PL12-P00, LXK2-PL12-Q00, LXK2-PL12-R00 Source: www.luxeon.com KINGBRIGHT: KA-3528ASYC Source: www.kingbright.com
LED6-LED8 = led-7-segment:LA-401*D: Single Digit LED Numeric Display (anode common) Source: ROHM .. la-1401dn.pdf; OC_FARNELL: unknown; OC_NEWARK: unknown
LOGO1 = SparkFun-Aesthetics:OSHW-LOGO: Open Source Hardware Logo This logo indicates the piece of hardware it is found on incorporates a OSHW license and/or adheres to the definition of open source hardware found here: http://freedomdefined.org/OSHW
R1-R4 R6-R35 = rcl:R-EU_: RESISTOR, European symbol
R5 = elatus:RCL_POTENTIOMETER_: Potentiometer
S1-S4 = elatus:CPU-K_MODULE_REV3.0_SWITCH-OMRON_10-XX: OMRON SWITCH
SP1 = CPU-k_module_Rev3.0:BUZZER_F/PMX04: SPEAKER Source: Buerklin
SV2 = CPU-k_module_Rev3.0:CON-HARTING-ML_ML10: HARTING
SV3 = con-harting-ml:ML14: HARTING; OC_FARNELL: unknown; OC_NEWARK: unknown
SW1 = switch-alps:EC12E_SW: ALPS rotary Encoder EC12E series with switch; MPN: EC12E2424407; OC_FARNELL: 1520813; OC_NEWARK: 74M1068
T1 = elatus:TRANSISTOR_BC337: NPN TRANSISTOR
U$1 = hsa_stm32_discovery_board:STM32DISCOVERY
U$2 = hsa_stm32_discovery_board:USB_TO_SERIAL_ADAPTER
U$4 = hsa_stm32_discovery_board:KIPPSCHALTER(EIN,AUS,EIN)
U$5 = hsa_stm32_discovery_board:MIC
U$6 = hsa_stm32_discovery_board:BATTERIEHALTER
U$7 = hsa_stm32_discovery_board:BATTERIEHALTER_9V
U$9 = hsa_stm32_discovery_board:AUDIO_AMPLIFIER
U$10 = hsa_stm32_discovery_board:RTC
U$12 = hsa_stm32_discovery_board:MICRO_SD_HALTER
U$17 = hsa_stm32_discovery_board:THUMBWHEEL_POTI
X1 = con-conrad:73398?: FEMALE PRINT CONNECTOR Niedervolt-Steckverbinder Distributor Conrad
X2 = con-wago-500:W237-4: WAGO SCREW CLAMP; OC_FARNELL: unknown; OC_NEWARK: unknown

## Board
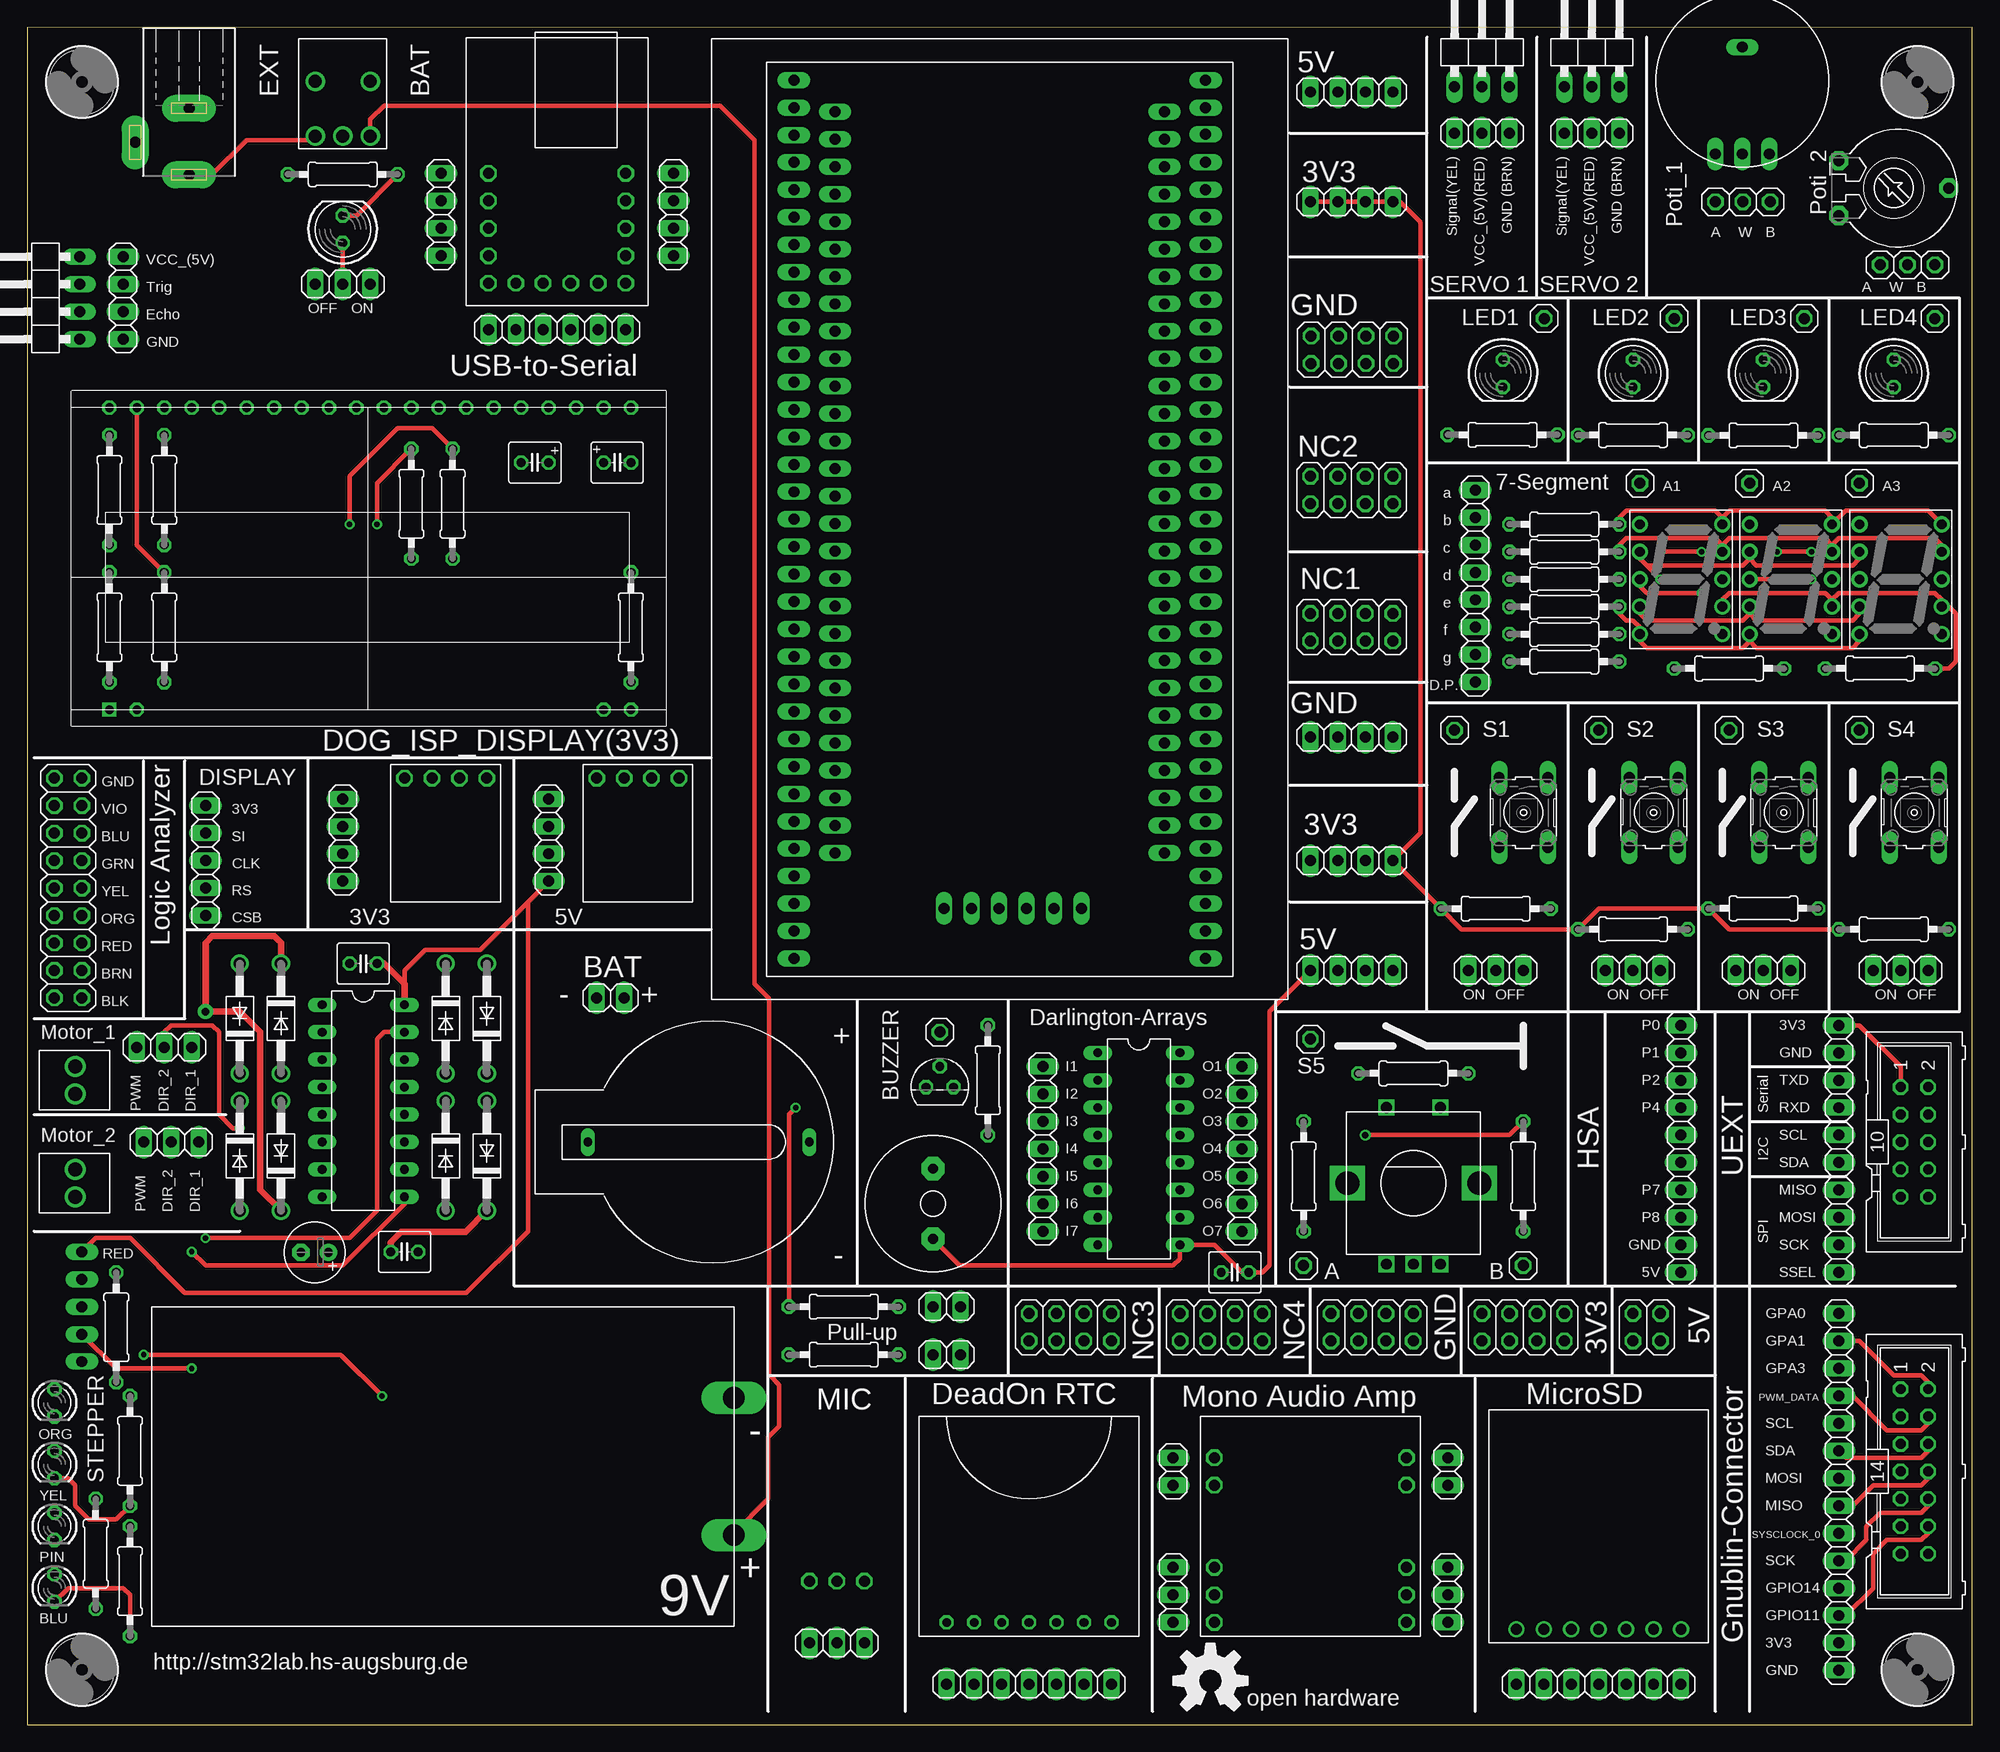
[diagram p3: board, top side]
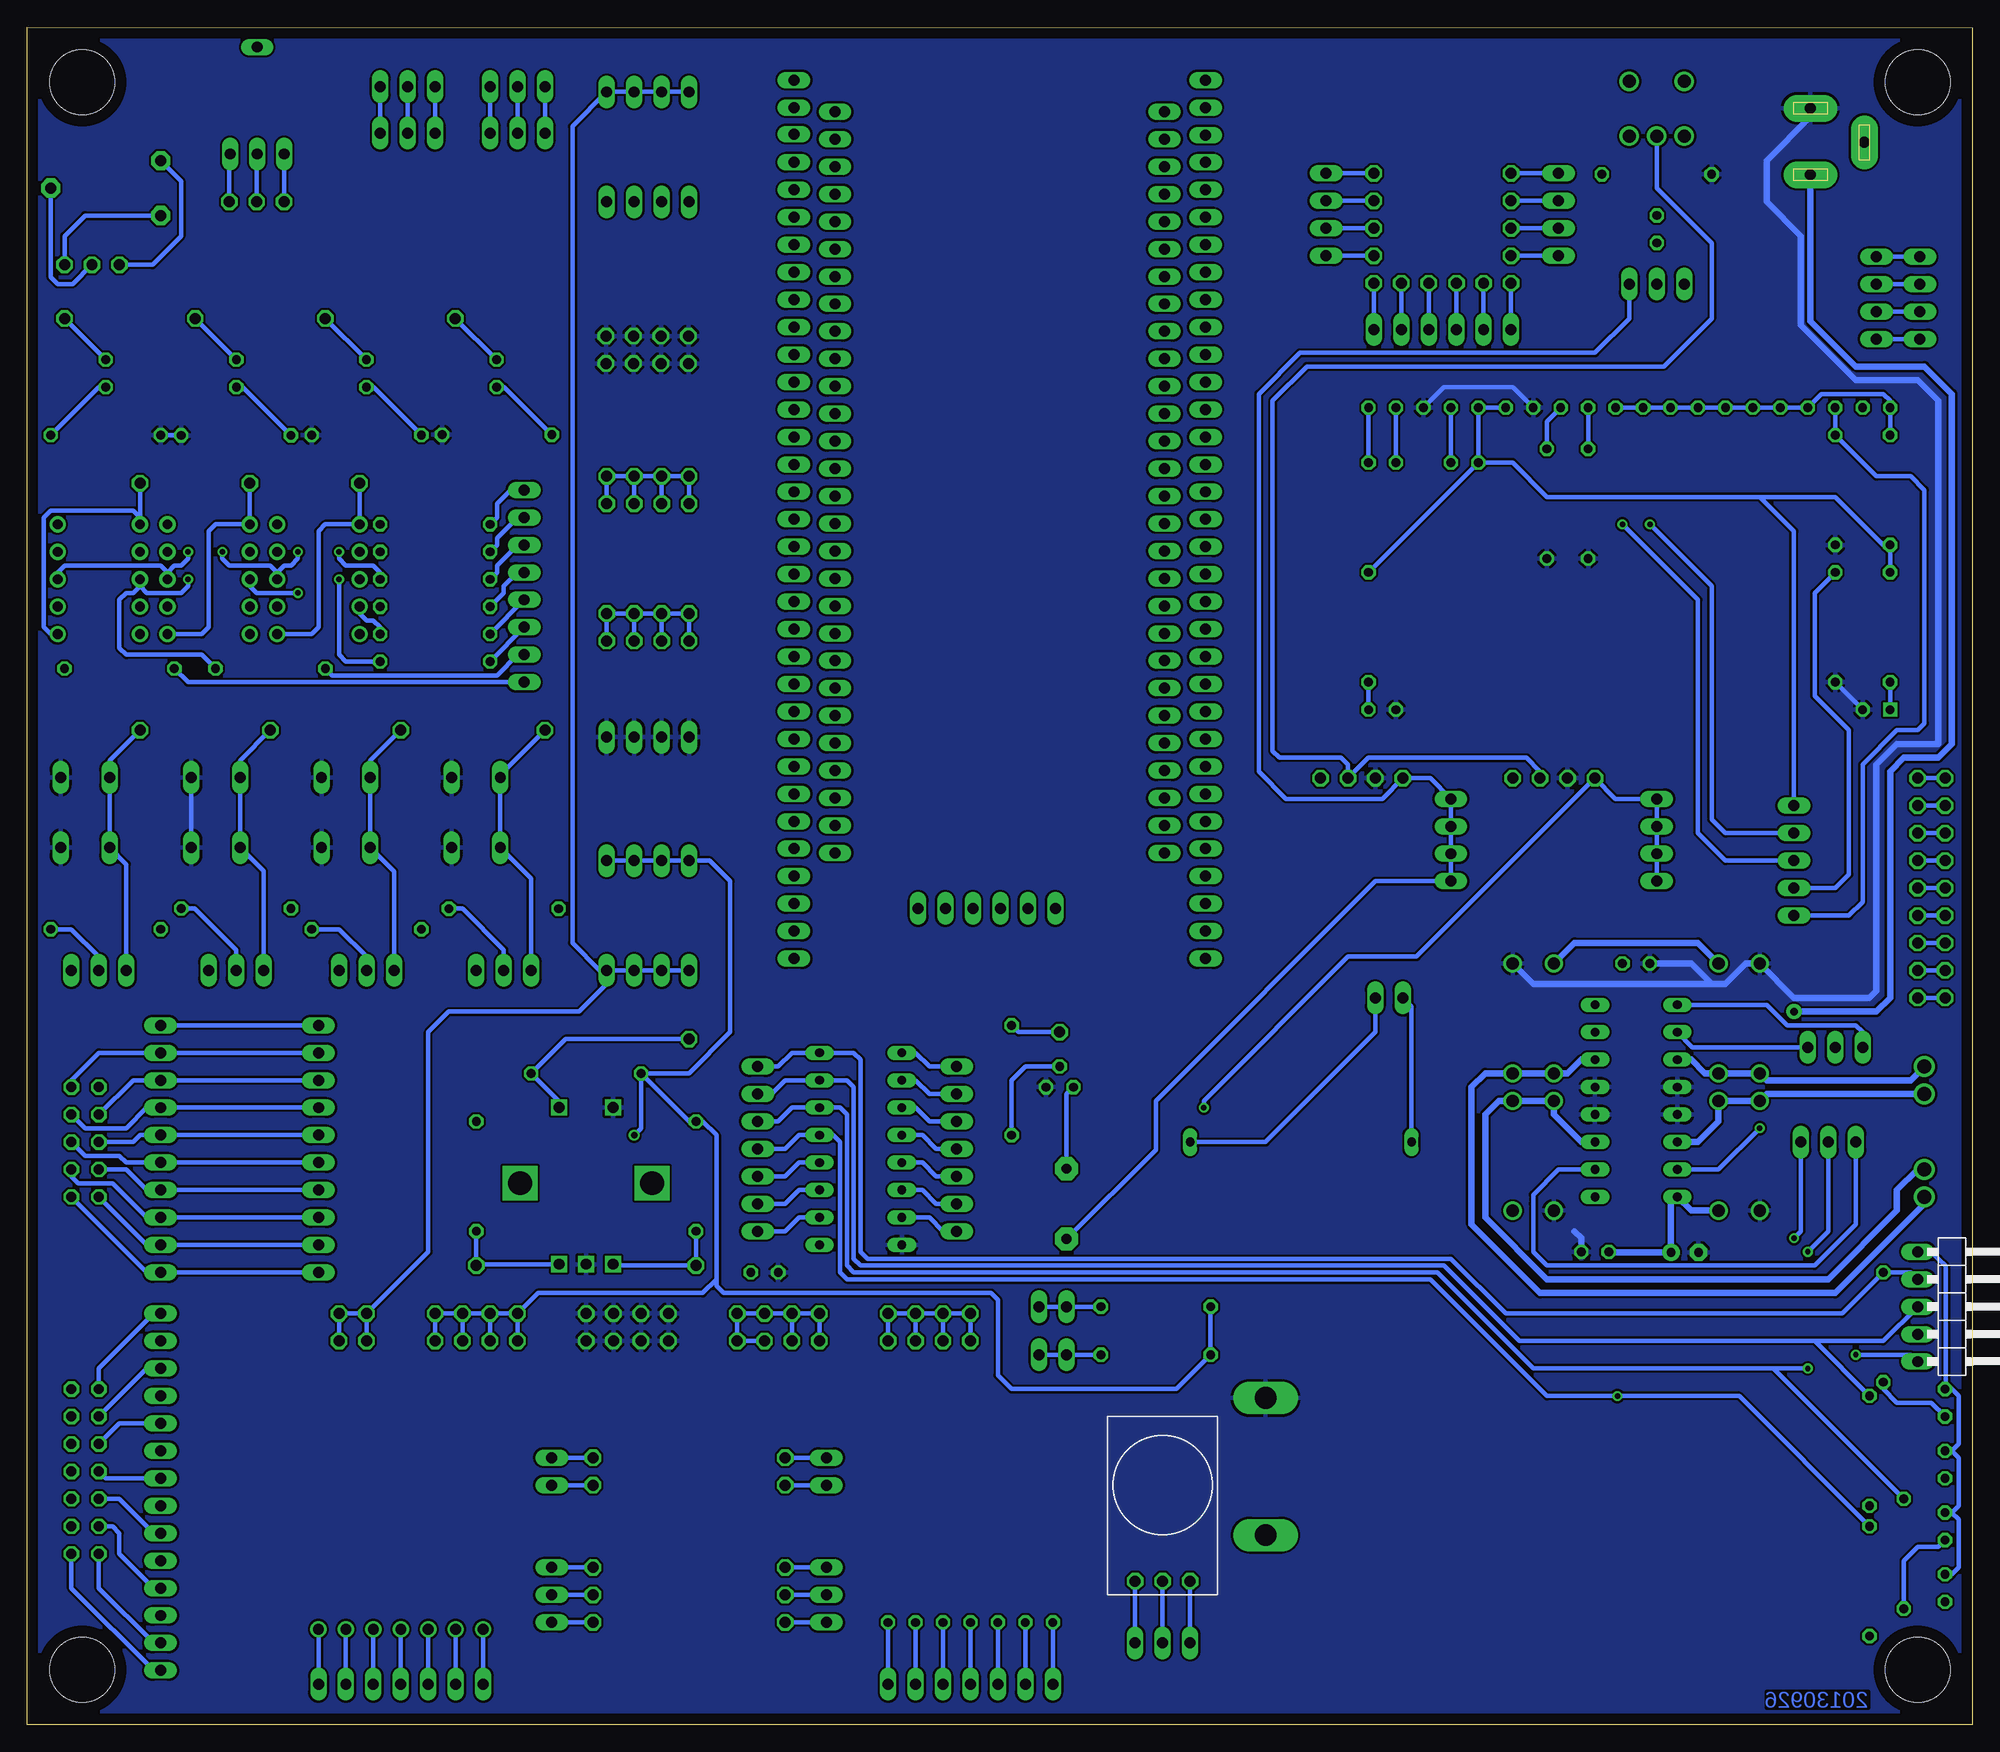
[diagram p4: board, bottom side, seen from below]

Size 180 x 157.08 mm. Coordinates in mm from the lower left corner, seen from the top.
Outline: 0,0 180,0 180,157.08 0,157 0,0
Copper layers (1*16): Top 0.035mm / dielectric 1.5mm / Bottom 0.035mm
Design rules "default *": minimum track width 10mil, minimum drill 0.5mm, track to track 8mil, track to pad 8mil, pad to pad 8mil, via to via 8mil, smd to smd 8mil, copper to edge 40mil, drill to drill 8mil, minimum pad ring 10mil, minimum via ring 8mil, stop-mask expansion 4mil, vias tented up to drill 0mil, thermal gap 10mil

### Footprints (pad centres in the part's own frame; a part is rotated, then mirrored left to right if it is on the bottom)
VOL_REG = drill 1.016 octagon: GND 11.43,6.35; SHDN_N 11.43,1.27; VIN 11.43,3.81; VOUT 11.43,8.89
C025-040X050 = drill 0.813 octagon: 1 -1.27,0; 2 1.27,0
RCL_C025-040X050 = drill 0.813 octagon: 1 -1.27,0; 2 1.27,0
RCL_E2,5-6 = drill 0.813 pad 1.6: + -1.27,0 | drill 0.813 pad 1.6 octagon: - 1.27,0
DO41-10 = drill 1.118: A 5.08,0; C -5.08,0
6,0 = hole 6: 0,0
DIL16 = drill 0.813 long: 1 -8.89,-3.81; 2 -6.35,-3.81; 3 -3.81,-3.81; 4 -1.27,-3.81; 5 1.27,-3.81; 6 3.81,-3.81; 7 6.35,-3.81; 8 8.89,-3.81; 9 8.89,3.81; 10 6.35,3.81; 11 3.81,3.81; 12 1.27,3.81; 13 -1.27,3.81; 14 -3.81,3.81; 15 -6.35,3.81; 16 -8.89,3.81
1X05 = drill 1.016 long: 1 -5.08,0; 2 -2.54,0; 3 0,0; 4 2.54,0; 5 5.08,0
1X01 = drill 1.016 octagon: 1 0,0
1X03 = drill 1.016 long: 1 -2.54,0; 2 0,0; 3 2.54,0
2X04 = drill 1.016 octagon: 1 -3.81,-1.27; 2 -3.81,1.27; 3 -1.27,-1.27; 4 -1.27,1.27; 5 1.27,-1.27; 6 1.27,1.27; 7 3.81,-1.27; 8 3.81,1.27
1X10 = drill 1.016 long: 1 -11.43,0; 2 -8.89,0; 3 -6.35,0; 4 -3.81,0; 5 -1.27,0; 6 1.27,0; 7 3.81,0; 8 6.35,0; 9 8.89,0; 10 11.43,0
1X07 = drill 1.016 long: 1 -7.62,0; 2 -5.08,0; 3 -2.54,0; 4 0,0; 5 2.54,0; 6 5.08,0; 7 7.62,0
1X08 = drill 1.016 long: 1 -8.89,0; 2 -6.35,0; 3 -3.81,0; 4 -1.27,0; 5 1.27,0; 6 3.81,0; 7 6.35,0; 8 8.89,0
1X04 = drill 1.016 long: 1 -3.81,0; 2 -1.27,0; 3 1.27,0; 4 3.81,0
1X05/90 = drill 1.016 long: 1 -5.08,-3.81; 2 -2.54,-3.81; 3 0,-3.81; 4 2.54,-3.81; 5 5.08,-3.81
1X04/90 = drill 1.016 long: 1 -3.81,-3.81; 2 -1.27,-3.81; 3 1.27,-3.81; 4 3.81,-3.81
1X02 = drill 1.016 long: 1 -1.27,0; 2 1.27,0
1X06 = drill 1.016 long: 1 -6.35,0; 2 -3.81,0; 3 -1.27,0; 4 1.27,0; 5 3.81,0; 6 6.35,0
1X03/90 = drill 1.016 long: 1 -2.54,-3.81; 2 0,-3.81; 3 2.54,-3.81
2X09 = drill 1.016 octagon: 1 -10.16,-1.27; 2 -10.16,1.27; 3 -7.62,-1.27; 4 -7.62,1.27; 5 -5.08,-1.27; 6 -5.08,1.27; 7 -2.54,-1.27; 8 -2.54,1.27; 9 0,-1.27; 10 0,1.27; 11 2.54,-1.27; 12 2.54,1.27; 13 5.08,-1.27; 14 5.08,1.27; 15 7.62,-1.27; 16 7.62,1.27; 17 10.16,-1.27; 18 10.16,1.27
1X14 = drill 1.016 long: 1 -16.51,0; 2 -13.97,0; 3 -11.43,0; 4 -8.89,0; 5 -6.35,0; 6 -3.81,0; 7 -1.27,0; 8 1.27,0; 9 3.81,0; 10 6.35,0; 11 8.89,0; 12 11.43,0; 13 13.97,0; 14 16.51,0
2X02 = drill 1.016 octagon: 1 -1.27,-1.27; 2 -1.27,1.27; 3 1.27,-1.27; 4 1.27,1.27
691210910002 = drill 1.3: 1 -2.54,0; 2 0,0
ZEITERFASSUNG_-OPTO_DOGM = drill 0.8 square: 1 0,0 | drill 0.8 octagon: 2 2.54,0; 19 45.72,0; 20 48.26,0; 21 48.26,27.94; 22 45.72,27.94; 23 43.18,27.94; 24 40.64,27.94; 25 38.1,27.94; 26 35.56,27.94; 27 33.02,27.94; 28 30.48,27.94; 29 27.94,27.94; 30 25.4,27.94; 31 22.86,27.94; 32 20.32,27.94; 33 17.78,27.94; 34 15.24,27.94; 35 12.7,27.94; 36 10.16,27.94; 37 7.62,27.94; 38 5.08,27.94; 39 2.54,27.94; 40 0,27.94
LED5MM = drill 0.813 octagon: A -1.27,0; K 1.27,0
LA-401 = drill 0.9 pad 1.5: 1 -3.81,5.08; 2 -3.81,2.54; 3 -3.81,0; 4 -3.81,-2.54; 5 -3.81,-5.08; 6 3.81,-5.08; 7 3.81,-2.54; 8 3.81,0; 9 3.81,2.54; 10 3.81,5.08
LED3MM = drill 0.813 octagon: A -1.27,0; K 1.27,0
0207/10 = drill 0.813 octagon: 1 -5.08,0; 2 5.08,0
RCL_PT-10 = drill 1.016 pad 1.778 octagon: 1 -2.54,-5.08; 2 2.54,-5.08; 3 0,5.08
CPU-K_MODULE_REV3.0_SWITCH-OMRON_B3F-10XX = drill 1.016 long: 1 -3.251,2.261; 2 3.251,2.261; 3 -3.251,-2.261; 4 3.251,-2.261
BUZZER_F/PMX04A = drill 0.914 pad 2.159 octagon: + 3.251,0; - -3.251,0
CON-HARTING-ML_ML10 = drill 0.914 octagon: 1 -5.08,-1.27; 2 -5.08,1.27; 3 -2.54,-1.27; 4 -2.54,1.27; 5 0,-1.27; 6 0,1.27; 7 2.54,-1.27; 8 2.54,1.27; 9 5.08,-1.27; 10 5.08,1.27
ML14 = drill 0.914 octagon: 1 -7.62,-1.27; 2 -7.62,1.27; 3 -5.08,-1.27; 4 -5.08,1.27; 5 -2.54,-1.27; 6 -2.54,1.27; 7 0,-1.27; 8 0,1.27; 9 2.54,-1.27; 10 2.54,1.27; 11 5.08,-1.27; 12 5.08,1.27; 13 7.62,-1.27; 14 7.62,1.27
ALPS_EC12E_SW = drill 1 square: A -2.5,-7.5; B 2.5,-7.5; C 0,-7.5; D -2.5,7; E 2.5,7 | drill 2.2 square: GND1 -6.1,0; GND2 6.1,0
TRANSISTOR_TO92 = drill 0.813 octagon: 1 1.27,0; 2 0,1.905; 3 -1.27,0
STM32DISCOVERY = drill 1.016 long: 3V3_EXT_VL 11.43,77.08; 3V_F0 7.62,85.09; 5V_F0 45.72,85.09; BOOT0_F0 45.72,72.39; BOOT0_VL 41.91,69.46; EXT_5V_VL 41.91,77.08; GND_0_L_F0 7.62,82.55; GND_0_L_VL 11.43,82.16; GND_1_L_F0 7.62,64.77; GND_1_L_VL 11.43,13.58; GND_2_L_F0 7.62,3.81; GND_2_R_VL 41.91,82.16; GND_3_R_F0 45.72,82.55; GND_3_R_VL 41.91,13.58; GND_4_R_F0 45.72,3.81; NC_L_VL 11.43,79.62; NC_R_VL 41.91,79.62; NRST_F0 7.62,62.23; PA0_F0 7.62,49.53; PA0_VL 11.43,46.6; PA1_F0 7.62,46.99; PA1_VL 11.43,44.06; PA2_F0 7.62,44.45; PA2_VL 11.43,41.52; PA3_F0 7.62,41.91; PA3_VL 11.43,38.98; PA4_F0 7.62,34.29; PA4_VL 11.43,36.44; PA5_F0 7.62,31.75; PA5_VL 11.43,33.9; PA6_F0 7.62,29.21; PA6_VL 11.43,31.36; PA7_F0 7.62,26.67; PA7_VL 11.43,28.82; PA8_F0 45.72,24.13; PA8_VL 41.91,26.28; PA9_F0 45.72,26.67; PA9_VL 41.91,28.82; PA10_F0 45.72,29.21; PA10_VL 41.91,31.36; PA11_F0 45.72,31.75; PA11_VL 41.91,33.9; PA12_F0 45.72,34.29; PA12_VL 41.91,36.44; PA13_F0 45.72,36.83; PA13_VL 41.91,38.98; PA14_F0 45.72,44.45; PA14_VL 41.91,41.52; PA15_F0 45.72,46.99; PA15_VL 41.91,44.06; PB0_F0 7.62,19.05; PB0_VL 11.43,21.2; PB1_F0 7.62,16.51; PB1_VL 11.43,18.66; PB2_F0 7.62,13.97; PB2_VL 11.43,16.12; PB3_F0 45.72,59.69; PB3_VL 41.91,56.76; PB4_F0 45.72,62.23; PB4_VL 41.91,59.3; PB5_F0 45.72,64.77; PB5_VL 41.91,61.84; PB6_F0 45.72,67.31; PB6_VL 41.91,64.38; PB7_F0 45.72,69.85; PB7_VL 41.91,66.92; PB8_F0 45.72,77.47; PB8_VL 41.91,72; PB9_F0 45.72,80.1; PB9_VL 41.91,74.54; PB10_F0 7.62,11.43; PB10_VL 21.53,8.45; PB11_F0 7.62,8.89; PB11_VL 24.07,8.45; PB12_F0 7.62,6.35; PB12_VL 26.61,8.45; PB13_F0 45.72,6.35; PB13_VL 29.15,8.45; PB14_F0 45.72,8.89; PB14_VL 31.69,8.45; PB15_F0 45.72,11.43; PB15_VL 34.23,8.45; PC0_F0 7.62,59.69; PC0_VL 11.43,56.76; PC1_F0 7.62,57.15; PC1_VL 11.43,54.22; PC2_F0 7.62,54.61; PC2_VL 11.43,51.68; PC3_F0 7.62,52.07; PC3_VL 11.43,49.14; PC4_F0 7.62,24.13; PC4_VL 11.43,26.28; PC5_F0 7.62,21.59; PC5_VL 11.43,23.74; PC6_F0 45.72,13.97; PC6_VL 41.91,16.12; PC7_F0 45.72,16.51; PC7_VL 41.91,18.66; PC8_F0 45.72,19.05; PC8_VL 41.91,21.2; PC9_F0 45.72,21.59; PC9_VL 41.91,23.74; PC10_F0 45.72,49.53; PC10_VL 41.91,46.6; PC11_F0 45.72,52.07; PC11_VL 41.91,49.14; PC12_F0 45.72,54.61; PC12_VL 41.91,51.68; PC13_F0 7.62,77.47; PC13_VL 11.43,72; PC14_F0 7.62,74.93; PC14_VL 11.43,69.46; PC15_F0 7.62,72.39; PC15_VL 11.43,66.92; PD0_VL 11.43,64.38; PD1_VL 11.43,61.84; PD2_F0 45.72,57.15; PD2_VL 41.91,54.22; PF0_F0 7.62,69.85; PF1_F0 7.62,67.31; PF4_F0 7.62,39.37; PF5_F0 7.62,36.83; PF6_F0 45.72,39.37; PF7_F0 45.72,41.91; RESET_VL 11.43,59.3; VBAT_EXT_VL 11.43,74.54; VBAT_F0 7.62,80.01; VDD_F0 45.72,74.93
USB_TO_SERIAL = drill 1.016 octagon: 1 12.54,14.75; 2 15.08,14.75; 3 17.62,14.75; 4 20.16,14.75; 5 22.7,14.75; 6 22.7,12.21; 7 22.7,9.67; 8 22.7,7.1; 9 22.7,4.59; 10 22.7,2.05; 11 20.16,2.05; 12 17.62,2.05; 13 15.08,2.05; 14 12.54,2.05
KIPPSCHALTER = drill 1.2: 1 0,0; 2 2.54,0; 3 5.08,0; P$2 0,5.08; P$4 5.08,5.08
MIC = drill 1.016 octagon: 1 1.27,7.62; 2 1.27,5.08; 3 1.27,2.54
BH_KZH_20 = drill 0.8 long: 1 0,20.5; 2 0,0
BATTERIEHALTER_9V = drill 2 long: 1 0,21.135; 2 0,8.435
AUDIO_AMPLIFIER = drill 1.016 octagon: 1 1.27,16.51; 2 1.27,13.97; 3 1.27,6.35; 4 1.27,3.81; 5 1.27,1.27; 6 19.05,16.51; 7 19.05,13.97; 8 19.05,6.35; 9 19.05,3.81; 10 19.05,1.27
RTC = drill 0.8 octagon: 1 2.54,1.27; 2 5.08,1.27; 3 7.62,1.27; 4 10.16,1.27; 5 12.7,1.27; 6 15.24,1.27; 7 17.78,1.27
MIKRO_SD_HALTER = drill 1: 1 20.32,2.54; 2 20.32,5.08; 3 20.32,7.62; 4 20.32,10.16; 5 20.32,12.7; 6 20.32,15.24; 7 20.32,17.78
THUMBWHEEL_POTI = drill 1 long: 1 0,0.6; 2 2.5,0.6; 3 5,0.6; 4 2.5,10.5
733980-62 = drill 1 pad 2.5 long: 1 0,8.57; 2 0,2.42; 3 5,5.57
W237-4 = drill 1.194 long: 1 -7.5,-1.27; 2 -2.5,-1.27; 3 2.5,-1.27; 4 7.5,-1.27

### Placement (x,y rotation side)
3V3  43.82,76.14 90 top
5V  61.6,76.14 90 top
C2  54.61,116.78 180 top
C3  46.99,116.78 0 top
C4  31.12,70.42 180 top
C5  34.93,43.75 0 top
C6  111.76,41.85 180 top
C7  26.62,43.71 180 top
D1  42.55,52.64 90 top
D2  38.74,65.34 270 top
D3  38.74,52.64 270 top
D4  42.55,65.34 90 top
D5  23.5,52.64 90 top
D6  23.5,65.34 270 top
D7  19.69,52.64 270 top
D8  19.69,65.34 90 top
H1  174.9,151.98 0 top
H2  5.08,151.98 0 top
H3  174.9,5.08 0 top
H4  5.08,5.08 0 top
IC1  102.87,53.28 270 top
IC2  31.12,57.72 270 top
JP1  16.51,79.95 90 top
JP2  118.11,42.48 0 top
JP3  138.43,42.48 0 top
JP4  29.21,133.29 180 top
JP5  140.37,130.11 0 top
JP6  152.41,130.11 0 top
JP7  164.44,130.11 0 top
JP8  176.53,130.11 0 top
JP9  132.08,92.01 0 top
JP10  145.42,92.01 0 top
JP11  157.48,92.01 0 top
JP12  169.55,92.01 0 top
JP13  118.75,63.44 0 top
JP14  173.99,135.08 0 top
JP15  176.53,135.08 0 top
JP16  171.45,135.08 0 top
JP17  84.46,64.07 0 top
JP18  122.62,127.22 0 top
JP20  167.64,53.28 270 top
JP21  112.4,53.28 270 top
JP22  133.99,105.35 90 top
JP23  149.23,114.87 0 top
JP24  8.89,132.02 270 top
JP25  1.27,38.67 270 bottom
JP26  93.98,53.28 270 top
JP27  1.07,132.02 90 top
JP28  48.26,81.85 90 top
JP29  29.21,81.85 90 top
JP30  74.93,7.56 180 top
JP31  131.45,23.43 270 top
JP32  106.05,23.43 90 top
JP33  106.05,12 90 top
JP34  131.45,12 270 top
JP35  92.71,3.75 180 top
JP36  59.81,139.73 270 top
JP37  38.31,139.73 90 top
JP38  49.04,129.08 180 top
JP39  145.42,3.75 180 top
JP40  122.56,69.79 180 top
JP41  122.56,79.95 180 top
JP42  122.56,91.38 180 top
JP43  53.98,67.25 180 top
JP44  122.56,114.24 180 top
JP45  122.56,101.54 180 top
JP47  122.56,140.91 180 top
JP48  122.56,151.07 180 top
JP49  134.62,155.38 0 top
JP50  134.62,147.26 180 top
JP51  144.78,155.38 0 top
JP52  144.78,147.26 180 top
JP53  161.29,140.91 90 top
JP54  158.75,140.91 90 top
JP55  156.21,140.91 90 top
JP56  3.81,77.41 90 top
JP57  12.7,62.68 0 top
JP58  13.34,53.91 0 top
JP59  173.36,69.79 180 top
JP60  160.66,69.79 180 top
JP61  148.59,69.79 180 top
JP62  135.89,69.79 180 top
JP63  153.04,53.28 270 top
JP64  167.64,21.53 270 top
JP65  85.09,34.23 0 top
JP66  85.09,38.67 0 top
JP67  124.46,36.77 0 top
JP68  96.52,36.77 0 top
JP69  110.49,36.77 0 top
JP70  138.43,36.77 0 top
JP71  149.86,36.77 0 top
JP72  159.39,114.87 0 top
JP73  169.55,114.87 0 top
K1  4.45,48.83 270 top
K2  4.45,58.36 270 top
LCD1  7.62,93.92 0 top
LED1  136.56,125.03 270 top
LED2  148.6,125.03 270 top
LED3  160.63,125.03 270 top
LED4  172.72,125.03 270 top
LED5  29.21,138.37 90 top
LED6  163.2,105.98 0 top
LED7  173.36,105.98 0 top
LED8  153.04,105.98 0 top
LED9  2.54,29.78 270 top
LED10  2.54,24.07 270 top
LED11  2.54,18.35 270 top
LED12  2.54,12.64 270 top
LOGO1  109.49,4.06 0 top
R1  136.53,119.35 180 top
R2  148.59,119.32 180 top
R3  160.66,119.29 180 top
R4  172.72,119.32 0 top
R5  172.72,142.18 270 top
R6  29.21,143.45 180 top
R7  55.88,101.54 90 top
R8  7.62,101.54 90 top
R9  12.7,101.54 270 top
R10  7.62,114.24 270 top
R11  35.56,112.97 90 top
R12  39.37,112.97 270 top
R13  12.7,114.24 90 top
R14  135.89,75.5 180 top
R15  148.59,73.59 180 top
R16  160.66,75.53 180 top
R17  172.72,73.6 180 top
R18  138.43,50.74 270 top
R19  118.11,50.74 90 top
R20  128.27,60.26 0 top
R21  88.9,59.63 90 top
R22  75.57,38.67 180 top
R23  75.57,34.23 180 top
R24  142.24,111.06 0 top
R25  142.24,108.52 0 top
R26  142.24,105.98 0 top
R27  142.24,103.44 0 top
R28  142.24,100.9 0 top
R29  142.24,98.36 0 top
R30  157.48,97.73 0 top
R31  171.45,97.73 0 top
R32  8.26,36.77 270 top
R33  6.35,15.81 270 top
R34  9.53,25.34 270 top
R35  9.53,13.27 270 top
S1  138.47,84.39 270 top
S2  150.5,84.39 270 top
S3  162.54,84.39 270 top
S4  174.63,84.39 270 top
SP1  83.82,48.2 270 top
SV2  174.63,53.91 270 top
SV3  174.63,23.43 270 top
SW1  128.27,50.1 0 top
T1  84.46,58.99 0 top
U$1  63.33,67.08 0 top
U$2  40.64,156.08 270 top
U$4  26.67,146.98 0 top
U$5  80.01,12 90 top
U$6  72.39,53.91 90 top
U$7  65.41,38.67 180 top
U$9  108.59,8.19 0 top
U$10  82.55,8.19 0 top
U$12  135.26,29.15 270 top
U$17  156.21,144.73 0 top
X1  15,151.98 180 top
X2  3.76,-7.13 0 top  (outside the outline)

### Tracks (layer width: path | path; a pad name or v marks a point on that pad's centre or on a via)
3.3V  (via drill 0.5, 0.6)
  Top 0.406: R17.2 157.5,73.6 R16.2 145.44,75.53 R15.2 132.72,73.59 R14.2 JP41.1 128.91,82.49 128.91,139 127,140.91 JP47.1 JP47.2 JP47.3 JP47.4 | v123.83,54.55 137.16,54.55 R18.1 | R22.2 70.48,56.45 v71.12,57.09
  Bottom 0.406: JP70.7 JP70.8 JP70.6 | JP70.2 JP70.4 | JP70.4 JP70.6 | JP70.5 JP70.6 | JP70.3 JP70.4 | JP70.1 JP70.2 | R20.1 118.75,55.82 R19.2 117.47,55.82 116.2,54.55 116.2,41.22 | R20.1 123.19,55.19 v123.83,54.55 | R22.2 R23.2 73.66,31.05 88.9,31.05 90.17,32.33 90.17,39.31 90.81,39.95 115.57,39.95 116.2,40.58 116.2,41.22 | JP29.1 JP29.2 JP29.3 JP29.4 33.02,85.67 3V3.VOUT 51.44,71.06 57.78,71.06 71.12,57.73 v71.12,57.09 | JP41.1 JP41.2 JP41.3 JP41.4 116.84,79.95 114.94,78.05 114.94,64.08 118.75,60.27 R20.1 | 116.2,41.22 117.47,39.95 132.72,39.95 JP70.2
5V
  Top 0.406: JP40.4 114.94,65.98 114.94,42.48 114.3,41.85 C6.1 112.39,41.85 109.86,44.39 IC1.9 106.68,43.12 106.05,42.48 86.28,42.48 SP1.+ | 46.35,76.14 46.35,45.66 40.64,39.95 14.61,39.95 9.53,45.02 6.35,45.02 JP25.1 | 46.35,76.14 JP28.1 | 46.35,76.14 41.91,71.69 36.83,71.69 34.92,69.79 34.92,68.52
  Top 0.6: C4.1 33.02,70.42 34.92,68.52 IC2.16
  Bottom 0.406: JP71.2 JP71.4 JP71.3 | JP71.1 JP71.2 | JP48.4 JP48.3 JP48.2 JP48.1 129.54,147.9 129.54,72.33 127,69.79 JP40.1 | JP40.4 JP40.3 JP40.2 JP40.1 | JP71.2 142.88,43.76 142.88,64.08 140.97,65.98 128.91,65.98 126.36,68.52 JP40.1 | SP1.+ 75.56,53.2 75.56,57.73 55.24,78.05 JP28.1 JP28.2 JP28.3 JP28.4 50.16,87.57 5V.VOUT 54.61,85.67 63.5,85.67 66.04,88.2 66.04,123.13 62.23,126.94 34.92,126.94 31.75,130.12 JP4.1 | JP25.1 3.81,43.76 3.17,43.12 3.16,43.12 2.49,42.45 2.49,31.64 1.91,31.05 | 1.91,31.05 1.27,30.42 1.27,25.98 1.91,25.34 | 1.91,31.05 LED9.A | LED10.A 1.91,25.34 | 1.91,25.34 1.27,24.7 1.27,20.26 1.91,19.62 | LED11.A 1.91,19.62 | 1.91,19.62 1.27,18.99 1.27,14.54 1.91,13.91 LED12.A
CLK_DOG  (via drill 0.5)
  Top 0.406: v32.38,111.06 32.38,114.88 R11.2
  Bottom 0.406: R11.2 LCD1.29 | JP1.3 22.86,79.95 25.4,82.49 25.4,104.08 v32.38,111.06
CSB_DOG
  Bottom 0.406: LCD1.38 R13.2 8.89,115.51 5.71,115.51 4.45,114.24 4.45,92.65 5.08,92.02 6.99,92.02 10.16,88.84 10.16,76.14 11.43,74.87 JP1.1
DIR_1_MO_1
  Bottom 0.406: IC2.2 25.91,62.68 JP57.3
DIR_1_MO_2  (via drill 0.5)
  Top 0.406: v16.51,45.02 29.84,45.02 32.38,47.56 32.38,63.44 33.02,64.08 IC2.15
  Bottom 0.406: JP58.3 15.88,45.66 v16.51,45.02
DIR_2_MO_1  (via drill 0.5)
  Top 0.406: v19.68,55.19 19.05,55.19 17.78,56.45 17.78,64.08 17.14,64.71 13.34,64.71 12.7,64.08 JP57.2
  Bottom 0.406: IC2.7 23.5,51.38 v19.68,55.19
DIR_2_MO_2
  Bottom 0.406: JP58.1 10.79,46.3 14.61,42.48 39.37,42.48 40.64,43.76 40.64,48.2 40.63,48.21 40.63,49.04 38.3,51.38 IC2.10 35.56,51.38
GND
  Top 0.6: D3.A 38.73,48.2
  Bottom 0.406: S3.2 S3.1 | LCD1.2 R9.2 | LCD1.27 42.55,123.77 48.9,123.77 LCD1.23 | R3.1 165.76,119.32 R4.1
  Bottom 0.6: X1.2 15,148.77 19.05,144.72 19.05,140.91 15.88,137.74 15.88,129.48 10.79,124.4 5.08,124.4 3.17,122.5 3.17,90.75 6.99,90.75 8.89,88.84 8.89,67.89 9.53,67.25 16.51,67.25 D8.A 20.95,70.42 22.86,68.52 24.13,68.52 | 24.13,68.52 40.64,68.52 D4.A | 24.13,68.52 26.04,70.42 C4.2 | C5.2 36.2,45.02 36.83,45.66
  pour Bottom: -7.04,164.74 187.92,161.06 181.87,-3.12 -3.3,-1.73
GNUB_3V3
  Bottom 0.406: JP64.13 168.28,7.56 173.35,12.64 SV3.13
GNUB_GND
  Bottom 0.406: JP64.14 168.28,5.02 175.9,12.64 SV3.14
GNUB_GPA0
  Bottom 0.406: JP64.1 168.28,38.04 173.35,32.96 SV3.1
GNUB_GPA1
  Top 0.406: SV3.2 175.9,31.69 175.26,32.33 172.72,32.33 169.54,35.5 JP64.2
GNUB_GPA3
  Bottom 0.406: JP64.3 168.91,32.96 SV3.3
GNUB_GPIO11
  Top 0.406: JP64.12 168.28,10.1 170.81,12.64 170.81,15.81 172.09,17.09 175.26,17.09 175.9,17.72 SV3.12
GNUB_GPIO14
  Bottom 0.406: JP64.11 168.28,12.64 171.45,15.81 171.45,17.72 172.09,18.36 SV3.11
GNUB_MISO
  Top 0.406: SV3.8 175.9,22.8 175.26,22.16 170.81,22.16 168.91,20.26 JP64.8
GNUB_MOSI
  Bottom 0.406: JP64.7 172.72,22.8 SV3.7
GNUB_PWM_DATA
  Top 0.406: SV3.4 175.9,27.88 175.26,27.25 172.09,27.25 168.91,30.42 JP64.4
GNUB_SCK
  Top 0.406: JP64.10 168.28,15.18 170.18,17.09 170.18,18.36 171.45,19.62 175.26,19.62 175.9,20.26 SV3.10
GNUB_SCL
  Bottom 0.406: JP64.5 171.45,27.88 SV3.5
GNUB_SDA
  Top 0.406: SV3.6 175.9,25.34 175.26,24.7 168.28,24.7 JP64.6
GNUB_SYSCLOCK_0
  Bottom 0.406: JP64.9 168.28,17.72 171.45,20.89 SV3.9
MOTOR_VCC  (via drill 0.7 pad 1.4)
  Top 0.406: X1.1 17.11,143.41 20.32,146.62 26.32,146.62 U$4.1
  Top 0.6: D6.C 23.5,72.33 22.86,72.97 17.14,72.97 16.51,72.33 v16.51,65.98 19.68,65.98 21.59,64.08 21.59,49.47 D5.C | D1.C 40.57,45.59 34.63,45.59 33.66,44.61 C5.1
  Bottom 0.406: 33.66,43.71 C5.1
  Bottom 0.6: X1.1 15,129.88 10.79,125.67 4.45,125.67 1.91,123.13 1.91,90.75 3.17,89.47 6.35,89.47 7.62,88.2 7.62,67.25 8.89,65.98 v16.51,65.98 | D2.C 36.83,72.33 25.4,72.33 D6.C | D5.C 26.04,47.56 IC2.8 27.89,48.25 C7.+ 33.66,43.71
N$1
  Bottom 0.406: C2.2 LCD1.22
N$2
  Bottom 0.406: C2.1 LCD1.21
N$3
  Bottom 0.406: LCD1.20 R7.1
N$4
  Bottom 0.406: R10.1 LCD1.40 7.62,122.5 8.26,123.13 13.97,123.13 LCD1.37 LCD1.36 LCD1.35 LCD1.34 LCD1.33 LCD1.32 LCD1.31 LCD1.30
N$5
  Bottom 0.406: LCD1.1 R8.1
N$6
  Bottom 0.406: C3.2 LCD1.24
N$7
  Bottom 0.406: R4.2 173.35,123.77 LED4.K
N$8
  Bottom 0.406: R3.2 160.04,123.77 LED3.K
N$9
  Bottom 0.406: R2.2 147.95,123.77 LED2.K
N$10
  Bottom 0.406: R1.2 135.85,123.77 LED1.K
N$12
  Bottom 0.406: SW1.A 125.77,42.48 JP2.1 R19.1
N$13
  Bottom 0.406: LED2.A JP6.1
N$14
  Bottom 0.406: LED3.A JP7.1
N$15
  Bottom 0.406: LED4.A JP8.1
N$16
  Bottom 0.406: 3V3.VIN 40.01,88.2 41.27,89.47 55.88,89.47 5V.VIN 57.78,88.84 58.42,89.47 64.14,89.47 64.77,90.11 64.77,122.5 61.59,125.67 28.57,125.67 24.13,130.12 24.13,137.1 29.21,142.18 U$4.2
N$17
  Bottom 0.406: LED9.K 3.81,29.79 6.99,29.79 8.26,31.05 R32.2
N$18
  Bottom 0.406: JP62.2 135.89,71.69 139.7,75.5 R14.1
N$19
  Bottom 0.406: JP61.2 148.59,71.06 151.13,73.6 R15.1
N$20
  Bottom 0.406: JP9.1 136.21,87.89 S1.3 S1.4 133.35,78.29 JP62.3
N$21
  Bottom 0.406: JP10.1 148.24,89.19 S2.3 S2.4 146.05,78.95 JP61.3
N$22
  Bottom 0.406: JP60.2 160.66,71.69 164.47,75.5 165.71,75.5 R16.1
N$23
  Bottom 0.406: R17.1 175.9,73.6 173.35,71.06 JP59.2
N$24
  Bottom 0.406: JP11.1 160.28,89.22 S3.3 S3.4 158.12,78.98 JP60.3
N$25
  Bottom 0.406: JP12.1 172.37,89.2 S4.3 S4.4 170.81,79.59 JP59.3
N$26
  Top 0.406: R34.2 8.26,18.99 5.71,18.99 4.45,20.26 4.45,22.16 3.81,22.8 LED10.K
N$27
  Top 0.406: U$4.3 31.75,148.53 33.02,149.8 64.14,149.8 67.31,146.62 67.31,68.52 68.64,67.19 68.64,32.4 69.59,31.46 69.59,27.61 68.58,26.6 68.58,20.89 65.41,17.72 U$7.1
N$28
  Top 0.406: LED5.K 30.48,139.64 R6.1
N$29
  Top 0.406: JP4.2 LED5.A
N$30
  Bottom 0.406: LED1.A JP5.1
N$31
  Bottom 0.406: SW1.B 138.43,42.6 | 138.43,42.6 JP3.1 | 138.43,42.6 R18.2
N$32
  Bottom 0.406: SW1.E 130.77,57.69 R20.2 130.18,63.44 JP13.1
N$33
  Bottom 0.406: JP14.1 175.78,133.29 177.16,133.29 177.8,133.93 R5.3
N$34
  Bottom 0.406: R5.1 165.74,142.81 165.74,137.74 168.39,135.08 JP16.1
N$35
  Bottom 0.406: JP15.1 176.53,137.74 174.62,139.64 R5.2
N$36
  Bottom 0.406: SP1.- 83.82,58.36 T1.3
N$37
  Bottom 0.406: U$6.2 65.41,53.91 55.24,64.08 JP43.1
N$38
  Bottom 0.6: K1.2 4.45,48.2 12.7,39.95 40.01,39.95 46.35,46.3 46.35,58.99 45.09,60.27 D4.C D2.A 37.47,60.27 36.2,61.53 IC2.14
N$39
  Bottom 0.406: JP17.1 88.27,64.08 R21.2
N$40
  Bottom 0.406: U$6.1 51.89,66.44 JP43.2
N$41
  Bottom 0.406: IC1.12 108.58,52.01 109.86,50.74 JP21.5
N$42
  Bottom 0.406: IC1.11 108.58,49.47 109.86,48.2 JP21.6
N$43
  Bottom 0.406: IC1.10 108.58,46.93 109.86,45.66 JP21.7
N$44
  Bottom 0.406: JP26.5 95.89,50.74 97.16,52.01 IC1.5
N$45
  Bottom 0.406: JP21.1 110.49,60.9 109.22,62.17 IC1.16 103.5,62.17 102.87,61.53 102.87,43.76 102.23,43.12 48.26,43.12 43.18,38.04 12.06,38.04 R32.1 5.71,41.85 JP25.2
N$46
  Bottom 0.406: 113.03,58.36 JP21.2 111.12,58.36 109.86,59.63 IC1.15 104.14,59.63 103.5,58.99 103.5,43.12 102.87,42.48 48.9,42.48 41.91,35.5 14.61,35.5 | R34.1 14.61,35.5 | JP25.3 8.26,35.5 14.61,35.5
N$47
  Bottom 0.406: JP26.6 95.89,48.2 97.16,49.47 IC1.6
N$48
  Bottom 0.406: JP26.7 95.25,45.66 96.52,46.93 IC1.7
N$49
  Bottom 0.406: JP56.2 JP56.1
N$50
  Bottom 0.406: JP56.4 JP56.3
N$51  (via drill 0.5)
  Top 0.406: JP25.4 8.26,32.96 v15.24,32.96
  Bottom 0.406: JP21.3 110.49,55.82 109.22,57.09 IC1.14 104.78,57.09 104.14,56.45 104.14,42.48 103.5,41.85 49.53,41.85 40.64,32.96 18.41,32.96 | R33.1 18.41,32.96 | v15.24,32.96 18.41,32.96
N$52  (via drill 0.5)
  Top 0.406: v10.79,34.23 29.03,34.23 v32.85,30.41
  Bottom 0.406: JP21.4 109.86,53.28 108.58,54.55 IC1.13 105.41,54.55 104.78,53.91 104.78,41.85 104.14,41.22 50.16,41.22 39.36,30.41 v32.85,30.41 32.84,30.42 21.59,30.42 R35.1 | JP25.5 5.71,34.23 v10.79,34.23
N$53
  Bottom 0.406: JP56.6 JP56.5
N$54
  Bottom 0.406: JP26.4 95.89,53.28 97.16,54.55 IC1.4
N$55
  Bottom 0.406: JP26.3 96.52,55.82 97.79,57.09 IC1.3
N$56
  Bottom 0.406: JP26.2 96.52,58.36 97.79,59.63 IC1.2
N$57
  Bottom 0.406: JP26.1 96.52,60.9 97.79,62.17 IC1.1
N$58
  Bottom 0.406: JP27.1 JP24.4
N$59
  Bottom 0.406: JP56.8 JP56.7
N$60
  Bottom 0.406: JP56.10 JP56.9
N$61
  Bottom 0.406: JP56.12 JP56.11
N$62
  Bottom 0.406: JP27.2 JP24.3
N$63
  Bottom 0.406: JP27.3 JP24.2
N$64
  Bottom 0.406: JP27.4 JP24.1
N$65
  Bottom 0.406: JP32.2 U$9.1
N$66
  Bottom 0.406: JP32.1 U$9.2
N$67
  Bottom 0.406: U$9.6 JP31.1
N$68
  Bottom 0.406: U$9.7 JP31.2
N$69
  Bottom 0.406: U$9.8 JP34.1
N$70
  Bottom 0.406: JP49.3 JP50.1
N$71
  Bottom 0.406: JP49.2 JP50.2
N$72
  Bottom 0.406: JP50.3 JP49.1
N$73
  Bottom 0.406: JP30.1 U$5.3
N$74
  Bottom 0.406: U$5.2 JP30.2
N$75
  Bottom 0.406: U$5.1 JP30.3
N$76
  Bottom 0.406: U$9.9 JP34.2
N$77
  Bottom 0.406: U$9.10 JP34.3
N$78
  Bottom 0.406: JP33.3 U$9.3
N$79
  Bottom 0.406: JP33.2 U$9.4
N$80
  Bottom 0.406: JP33.1 U$9.5
N$81
  Bottom 0.406: U$10.7 JP35.1
N$82
  Bottom 0.406: U$10.6 JP35.2
N$83
  Bottom 0.406: U$10.5 JP35.3
N$84
  Bottom 0.406: U$10.4 JP35.4
N$85
  Bottom 0.406: JP35.5 U$10.3
N$86
  Bottom 0.406: U$10.2 JP35.6
N$87
  Bottom 0.406: JP35.7 U$10.1
N$88
  Bottom 0.406: U$2.1 JP36.1
N$89
  Bottom 0.406: U$2.2 JP36.2
N$90
  Bottom 0.406: U$2.3 JP36.3
N$91
  Bottom 0.406: U$2.4 JP36.4
N$92
  Bottom 0.406: JP37.1 U$2.11
N$93
  Bottom 0.406: JP37.2 U$2.12
N$94
  Bottom 0.406: JP37.3 U$2.13
N$95
  Bottom 0.406: JP37.4 U$2.14
N$96
  Bottom 0.406: JP38.1 U$2.5
N$97
  Bottom 0.406: JP38.2 U$2.6
N$98
  Bottom 0.406: JP38.3 U$2.7
N$99
  Bottom 0.406: JP38.4 47.77,133.35 U$2.8
N$100
  Bottom 0.406: JP38.5 U$2.9
N$101
  Bottom 0.406: JP38.6 U$2.10
N$102
  Bottom 0.406: U$12.7 JP39.1
N$103
  Bottom 0.406: U$12.6 JP39.2
N$104
  Bottom 0.406: U$12.5 JP39.3
N$105
  Bottom 0.406: U$12.4 JP39.4
N$106
  Bottom 0.406: U$12.3 JP39.5
N$107
  Bottom 0.406: U$12.2 JP39.6
N$108
  Bottom 0.406: U$12.1 JP39.7
N$109
  Bottom 0.406: JP51.3 JP52.1
N$110
  Bottom 0.406: JP51.2 JP52.2
N$111
  Bottom 0.406: JP51.1 JP52.3
N$112
  Bottom 0.406: T1.2 87.63,60.9 88.9,59.63 R21.1
N$113
  Bottom 0.6: IC2.11 36.2,53.91 38.73,56.45 D3.C D1.A 43.81,57.73 45.09,56.45 45.09,46.93 39.37,41.22 13.34,41.22 6.99,47.56 6.99,49.47 5.08,51.38 K1.1
N$114
  Bottom 0.406: JP55.1 U$17.1
N$115
  Bottom 0.406: U$17.2 158.75,145.29 JP54.1
N$116
  Bottom 0.6: K2.1 5.71,59.63 19.05,59.63 D8.C D6.A 24.77,60.27 26.04,61.53 IC2.3
N$117
  Bottom 0.6: IC2.6 25.4,53.91 23.5,55.82 D5.A D7.C 19.05,58.36 K2.2
N$118
  Bottom 0.406: U$17.3 161.29,145.25 JP53.1
N$119
  Top 0.406: LED12.K 3.81,12.64 8.89,12.64 9.53,12.01 R35.2
N$120
  Bottom 0.406: LED11.K 3.17,16.45 5.08,16.45 6.35,15.18 R33.2
N$122
  Bottom 0.406: JP56.14 JP56.13
N$123
  Bottom 0.406: JP56.16 JP56.15
N$124
  Bottom 0.406: JP56.18 JP56.17
N$125
  Bottom 0.406: R23.1 JP65.1 JP65.2
N$126
  Bottom 0.406: R22.1 JP66.1 JP66.2
N$127
  Bottom 0.406: R24.1 136.53,111.7 136.53,112.97 135.25,114.24 JP22.8
N$128
  Bottom 0.406: JP44.8 JP44.7 JP44.5 | JP44.5 JP44.3 | JP44.3 JP44.1 JP44.2 | JP44.4 JP44.3 | JP44.6 JP44.5
N$131
  Top 0.406: R25.2 147.32,109.16 147.96,109.8 156.21,109.8 156.84,109.16 | LED7.9 177.16,109.16 176.53,109.8 167.64,109.8 167,109.16 | 167,109.16 LED6.9 | LED8.9 156.84,109.16 | 156.84,109.16 157.48,109.8 166.37,109.8 167,109.16
N$132
  Bottom 0.406: JP45.8 JP45.7 JP45.5 | JP45.5 JP45.3 | JP45.3 JP45.1 JP45.2 | JP45.6 JP45.5 | JP45.4 JP45.3
N$133  (via drill 0.5)
  Top 0.406: v165.1,108.53 v161.93,108.53 | v154.94,108.53 v151.13,108.53
  Bottom 0.406: LED7.8 177.16,106.62 176.53,107.25 167.64,107.25 167,106.62 | LED6.8 167,106.62 | 156.84,106.62 157.48,107.25 161.29,107.25 161.93,107.89 v161.93,108.53 | 156.84,106.62 LED8.8 | v165.1,108.53 165.1,107.89 165.74,107.25 166.37,107.25 167,106.62 | 156.84,106.62 156.21,107.25 155.57,107.25 154.94,107.89 v154.94,108.53 | v151.13,108.53 151.13,107.89 150.5,107.25 147.96,107.25 147.32,106.62 R26.2
N$134
  Top 0.406: 159.38,100.27 158.75,99.64 149.86,99.64 149.22,100.27 LED8.5 149.22,101.54 148.59,102.17 147.96,102.17 147.32,102.81 R27.2 | LED6.5 159.38,100.27 | 159.38,100.27 160.02,99.64 168.91,99.64 169.54,100.27 LED7.5
N$135
  Top 0.406: 159.38,102.81 160.02,102.17 168.91,102.17 169.54,102.81 LED7.4 | 159.38,102.81 LED6.4 | LED8.4 149.22,102.81 149.86,102.17 158.75,102.17 159.38,102.81
  Bottom 0.406: R28.2 147.32,101.54 147.96,102.17 148.59,102.17 149.22,102.81 LED8.4
N$136
  Bottom 0.406: JP68.3 JP68.4 | JP68.1 JP68.2 JP68.4 | JP68.7 JP68.8 JP68.6 | JP68.4 JP68.6 | JP68.5 JP68.6
N$139  (via drill 0.5)
  Top 0.406: LED7.2 169.54,107.89 168.91,107.25 160.02,107.25 159.38,107.89 | 159.38,107.89 LED6.2 | LED8.2 149.22,107.89 149.86,107.25 | 149.86,107.25 158.75,107.25 159.38,107.89 | v151.13,105.98 149.86,107.25
  Bottom 0.406: v151.13,105.98 151.13,99 150.5,98.36 R29.2
N$140
  Bottom 0.406: JP69.4 JP69.2 JP69.1 | JP69.4 JP69.3 | JP69.4 JP69.6 JP69.8 JP69.7 JP69.5
N$141  (via drill 0.5)
  Top 0.406: v165.1,105.98 LED6.3 | v154.94,104.72 149.86,104.72 149.22,105.35 LED8.3
  Bottom 0.406: LED7.3 169.54,105.35 | 169.54,105.35 168.91,104.72 165.74,104.72 165.1,105.35 v165.1,105.98 | LED6.3 159.38,105.35 158.75,104.72 v154.94,104.72 | R30.2 163.83,99 170.81,99 171.45,99.64 171.45,104.08 170.81,104.72 170.18,104.72 169.54,105.35
N$142
  Top 0.406: 167,104.08 167.64,104.72 176.53,104.72 177.16,104.08 LED7.7 177.8,103.44 178.44,102.81 178.44,98.36 177.8,97.73 R31.2 | LED6.7 167,104.08 | 167,104.08 166.37,104.72 157.48,104.72 156.84,104.08 LED8.7
N$143
  Top 0.406: R24.2 147.32,111.7 147.96,112.33 156.21,112.33 156.84,111.7 | LED8.10 156.84,111.7 | 156.84,111.7 157.48,112.33 166.37,112.33 167,111.7 LED6.10 168.28,112.33 175.9,112.33 LED7.10
N$144
  Bottom 0.406: R25.1 136.53,109.16 136.53,109.8 134.62,111.7 JP22.7
N$145
  Bottom 0.406: R26.1 136.53,106.62 136.53,107.25 134.62,109.16 JP22.6
N$146
  Bottom 0.406: R27.1 135.89,104.72 135.89,105.35 134.62,106.62 JP22.5
N$147
  Bottom 0.406: R28.1 JP22.4
N$148
  Bottom 0.406: R29.1 JP22.3
N$149
  Bottom 0.406: R30.1 151.76,97.09 136.53,97.09 134.62,99 JP22.2
N$150
  Bottom 0.406: R31.1 165.1,96.46 JP22.1
N$151
  Bottom 0.406: JP72.1 LED6.1 162.56,111.06 163.19,110.43 163.19,101.54 163.83,100.91 LED6.6
N$152
  Bottom 0.406: JP73.1 169.54,111.7 | 169.54,111.7 LED7.1 | LED7.6 177.8,100.91 178.44,101.54 178.44,111.7 177.8,112.33 170.18,112.33 169.54,111.7
N$153
  Bottom 0.406: JP23.1 LED8.1 152.4,111.06 153.03,110.43 153.03,101.54 153.67,100.91 LED8.6
PWM_MO_1
  Bottom 0.406: IC2.1 19.05,66.61 17.14,64.71 10.79,64.71 10.16,64.08 JP57.1
PWM_MO_2  (via drill 0.5)
  Top 0.406: v15.24,43.76 16.51,42.48 29.21,42.48 34.92,48.2 IC2.9
  Bottom 0.406: JP58.2 13.34,45.66 v15.24,43.76
RS_DOG
  Top 0.406: LCD1.39 10.16,109.16 R9.1
  Bottom 0.406: JP1.2 12.7,77.41 11.43,78.68 11.43,92.02 14.61,95.19 14.61,104.72 R9.1
SI_DOG  (via drill 0.5)
  Top 0.406: v29.84,111.06 29.84,115.51 34.29,119.95 37.47,119.95 R12.1
  Bottom 0.406: R12.1 39.37,120.59 LCD1.28 | JP1.4 22.86,82.49 24.13,83.76 24.13,105.35 v29.84,111.06
UEXT_3V3
  Top 0.406: SV2.1 173.35,60.9 169.54,64.71 JP20.1
  Bottom 0.406: JP63.1 JP20.1
UEXT_GND
  Bottom 0.406: JP63.2 JP20.2 173.35,62.17 175.9,59.63 SV2.2
UEXT_MISO
  Bottom 0.406: JP63.7 JP20.7 168.91,49.47 170.81,51.38 SV2.7
UEXT_MOSI
  Bottom 0.406: JP63.8 JP20.8 168.91,46.93 172.09,50.1 175.26,50.1 175.9,50.74 SV2.8
UEXT_RXD
  Bottom 0.406: JP63.4 JP20.4 168.91,57.09 170.81,55.19 174.62,55.19 SV2.4
UEXT_SCK
  Bottom 0.406: JP63.9 JP20.9 168.91,44.39 SV2.9
UEXT_SCL
  Bottom 0.406: JP63.5 JP20.5 169.54,54.55 170.18,53.91 SV2.5
UEXT_SDA
  Bottom 0.406: JP63.6 JP20.6 170.81,52.01 171.45,52.65 174.62,52.65 SV2.6
UEXT_SSEL
  Bottom 0.406: JP63.10 JP20.10 168.91,41.85 SV2.10
UEXT_TXD
  Bottom 0.406: JP63.3 JP20.3 170.18,59.63 SV2.3
V3V_DOG
  Bottom 0.406: R8.2 R10.2 8.26,109.16 12.7,113.61 19.68,113.61 | JP1.5 16.51,110.43 19.68,113.61 | 19.68,113.61 39.37,113.61 42.55,116.78 C3.1 | LCD1.26 LCD1.25 C3.1 | R7.2 C3.1

### Text on the board
Bottom: 20130926
tPlace: EXT | BAT | 5V | 3V3 | GND | LED1 | LED2 | LED3 | LED4 | USB-to-Serial | NC2 | + | + | 7-Segment | NC1 | GND | S1 | S2 | S3 | S4 | DOG_ISP_DISPLAY(3V3) | Logic Analyzer | GND | DISPLAY | VIO | 3V3 | 3V3 | BLU | SI | GRN | CLK | YEL | RS | 3V3 | 5V | ORG | CSB | 5V | RED | BRN | BAT | - | + | BLK | Darlington-Arrays | Motor_1 | + | S5 | BUZZER | PWM | DIR_2 | DIR_1 | Motor_2 | HSA | UEXT | PWM | DIR_2 | DIR_1 | RED | - | A | B | GND | NC3 | NC4 | 3V3 | 5V | Pull-up | DeadOn RTC | MicroSD | MIC | Mono Audio Amp | ORG | YEL | PIN | 9V | BLU | Gnublin-Connector | http://stm32lab.hs-augsburg.de | open hardware
tNames: Poti_2 | Signal(YEL) | VCC_(5V)(RED) | GND (BRN) | Signal(YEL) | VCC_(5V)(RED) | GND (BRN) | Poti_1 | A | W | B | VCC_(5V) | Trig | SERVO 1 | SERVO 2 | A | W | B | OFF | ON | Echo | GND | A1 | A2 | A3 | a | b | c | d | e | f | g | D.P. | ON | OFF | ON | OFF | ON | OFF | ON | OFF | P0 | 3V3 | P1 | GND | I1 | O1 | P2 | TXD | I2 | O2 | P4 | Serial | RXD | I3 | O3 | SCL | I4 | O4 | I2C | SDA | I5 | O5 | P7 | MISO | I6 | O6 | P8 | MOSI | I7 | O7 | SPI | GND | SCK | 5V | SSEL | GPA0 | GPA1 | GPA3 | PWM_DATA | SCL | SDA | STEPPER | MOSI | MISO | SYSCLOCK_0 | SCK | GPIO14 | GPIO11 | 3V3 | GND